# Altium project HU_revB.PrjPcb (part 2 of 4)

## Sheet RPI_CM5_PINOUT.SchDoc
size C; SheetNumber: 4; SheetTotal: 17
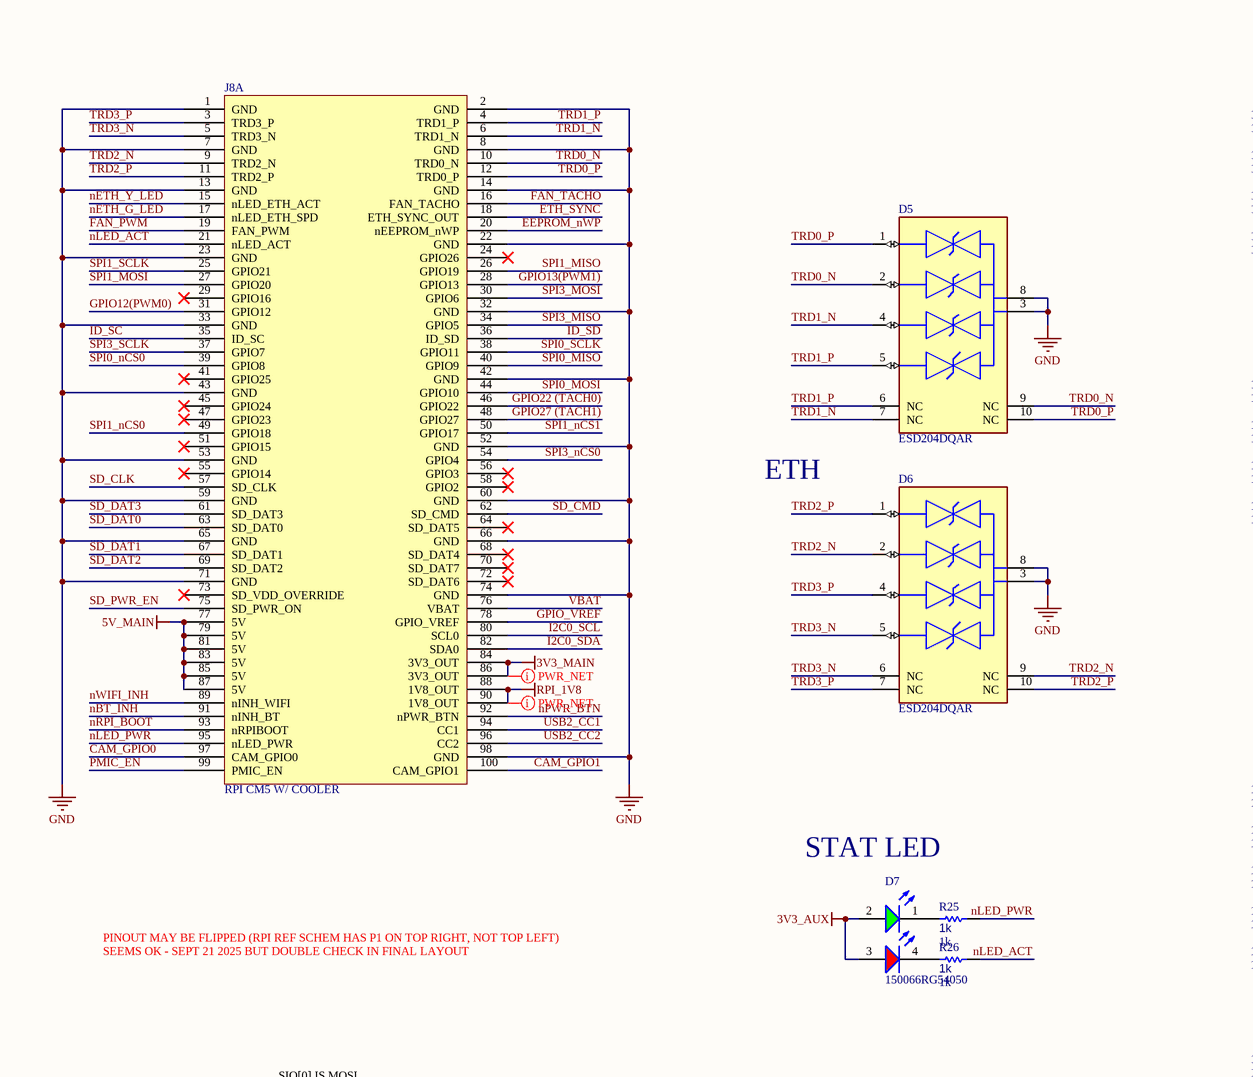
[diagram p6: RPI_CM5_PINOUT.SchDoc, top left]
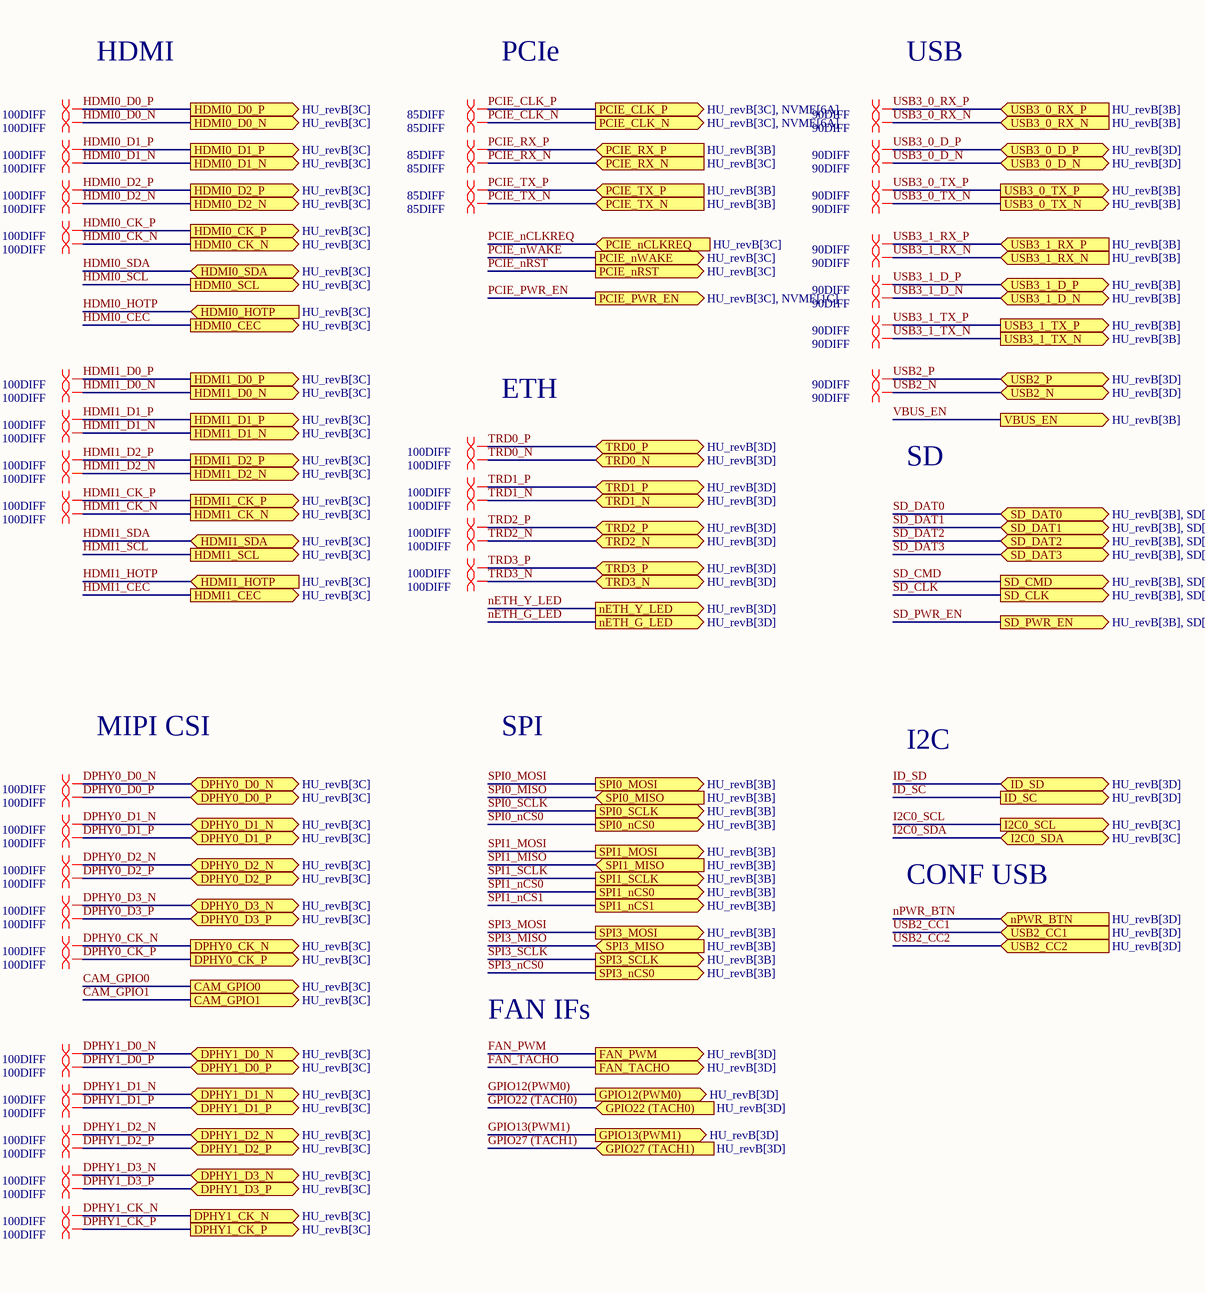
[diagram p7: RPI_CM5_PINOUT.SchDoc, top right]
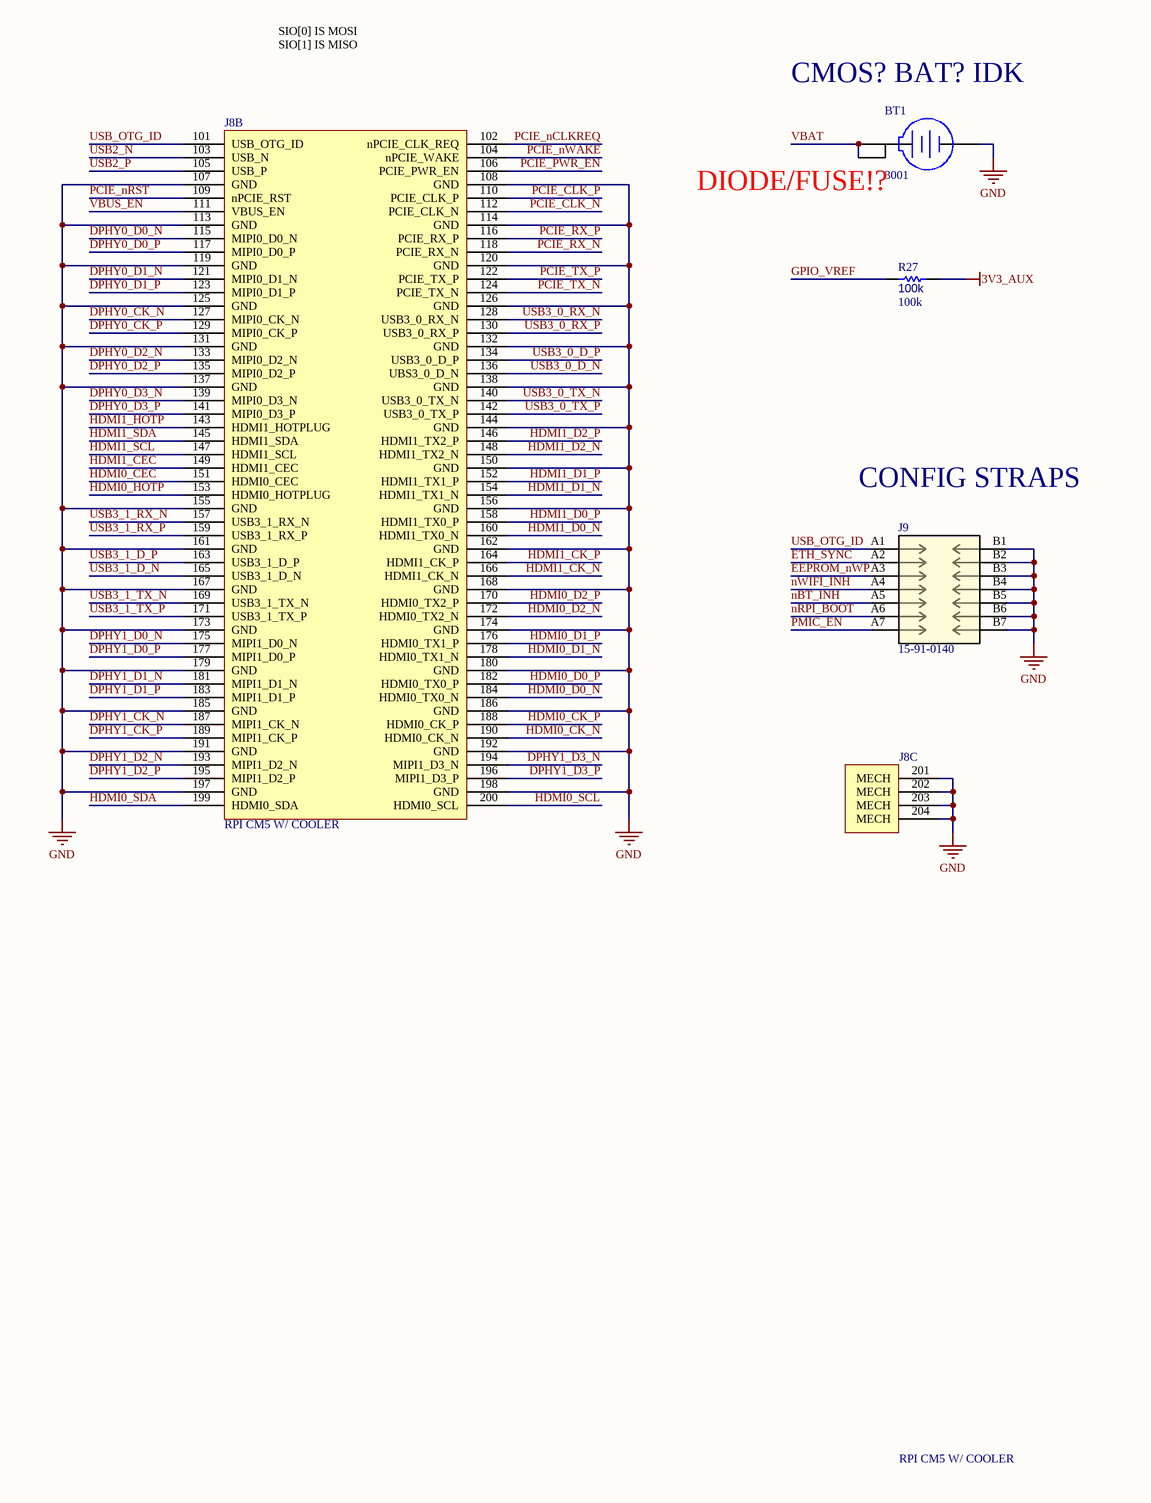
[diagram p8: RPI_CM5_PINOUT.SchDoc, bottom left]
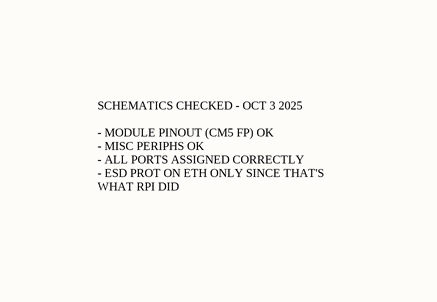
[diagram p9: RPI_CM5_PINOUT.SchDoc, bottom right]

### Parts
BT1  3001  [KSTN-3001_V]
D5  ESD204DQAR  [FP-DQA0010A-MFG]
D6  ESD204DQAR  [FP-DQA0010A-MFG]
D7  150066RG54050  [WL-SBCD_0606]
J8  RPI CM5 W/ COOLER  [RPI CM5 W_ COOLER-Footprint-1]  (parts A,B,C of 3)
J9  15-91-0140  [15-91-0140-Footprint-1]
R25  1k  [R0603B]
R26  1k  [R0603B]
R27  100k  [R0603B]

### Ports
CAM_GPIO0 (out, see HU_revB[3C]), CAM_GPIO1 (out, see HU_revB[3C]), DPHY0_CK_N (out, see HU_revB[3C]), DPHY0_CK_P (out, see HU_revB[3C]), DPHY0_D0_N (bidir, see HU_revB[3C]), DPHY0_D0_P (bidir, see HU_revB[3C]), DPHY0_D1_N (bidir, see HU_revB[3C]), DPHY0_D1_P (bidir, see HU_revB[3C]), DPHY0_D2_N (bidir, see HU_revB[3C]), DPHY0_D2_P (bidir, see HU_revB[3C]), DPHY0_D3_N (bidir, see HU_revB[3C]), DPHY0_D3_P (bidir, see HU_revB[3C]), DPHY1_CK_N (out, see HU_revB[3C]), DPHY1_CK_P (out, see HU_revB[3C]), DPHY1_D0_N (bidir, see HU_revB[3C]), DPHY1_D0_P (bidir, see HU_revB[3C]), DPHY1_D1_N (bidir, see HU_revB[3C]), DPHY1_D1_P (bidir, see HU_revB[3C]), DPHY1_D2_N (bidir, see HU_revB[3C]), DPHY1_D2_P (bidir, see HU_revB[3C]), DPHY1_D3_N (bidir, see HU_revB[3C]), DPHY1_D3_P (bidir, see HU_revB[3C]), FAN_PWM (out, see HU_revB[3D]), FAN_TACHO (out, see HU_revB[3D]), GPIO12(PWM0) (out, see HU_revB[3D]), GPIO13(PWM1) (out, see HU_revB[3D]), GPIO22 (TACH0) (in, see HU_revB[3D]), GPIO27 (TACH1) (in, see HU_revB[3D]), HDMI0_CEC (out, see HU_revB[3C]), HDMI0_CK_N (out, see HU_revB[3C]), HDMI0_CK_P (out, see HU_revB[3C]), HDMI0_D0_N (out, see HU_revB[3C]), HDMI0_D0_P (out, see HU_revB[3C]), HDMI0_D1_N (out, see HU_revB[3C]), HDMI0_D1_P (out, see HU_revB[3C]), HDMI0_D2_N (out, see HU_revB[3C]), HDMI0_D2_P (out, see HU_revB[3C]), HDMI0_HOTP (in, see HU_revB[3C]), HDMI0_SCL (out, see HU_revB[3C]), HDMI0_SDA (bidir, see HU_revB[3C]), HDMI1_CEC (out, see HU_revB[3C]), HDMI1_CK_N (out, see HU_revB[3C]), HDMI1_CK_P (out, see HU_revB[3C]), HDMI1_D0_N (out, see HU_revB[3C]), HDMI1_D0_P (out, see HU_revB[3C]), HDMI1_D1_N (out, see HU_revB[3C]), HDMI1_D1_P (out, see HU_revB[3C]), HDMI1_D2_N (out, see HU_revB[3C]), HDMI1_D2_P (out, see HU_revB[3C]), HDMI1_HOTP (in, see HU_revB[3C]), HDMI1_SCL (out, see HU_revB[3C]), HDMI1_SDA (bidir, see HU_revB[3C]), I2C0_SCL (out, see HU_revB[3C]), I2C0_SDA (bidir, see HU_revB[3C]), ID_SC (out, see HU_revB[3D]), ID_SD (bidir, see HU_revB[3D]), nETH_G_LED (out, see HU_revB[3D]), nETH_Y_LED (out, see HU_revB[3D]), nPWR_BTN (in, see HU_revB[3D]), PCIE_CLK_N (out, see HU_revB[3C], NVME[6A]), PCIE_CLK_P (out, see HU_revB[3C], NVME[6A]), PCIE_nCLKREQ (in, see HU_revB[3C]), PCIE_nRST (out, see HU_revB[3C]), PCIE_nWAKE (out, see HU_revB[3C]), PCIE_PWR_EN (out, see HU_revB[3C], NVME[1C]), PCIE_RX_N (in, see HU_revB[3C]), PCIE_RX_P (in, see HU_revB[3B]), PCIE_TX_N (in, see HU_revB[3B]), PCIE_TX_P (in, see HU_revB[3B]), SD_CLK (out, see HU_revB[3B], SD[3B]), SD_CMD (out, see HU_revB[3B], SD[3B]), SD_DAT0 (bidir, see HU_revB[3B], SD[3B]), SD_DAT1 (bidir, see HU_revB[3B], SD[3B]), SD_DAT2 (bidir, see HU_revB[3B], SD[3B]), SD_DAT3 (bidir, see HU_revB[3B], SD[3B]), SD_PWR_EN (out, see HU_revB[3B], SD[1B]), SPI0_MISO (in, see HU_revB[3B]), SPI0_MOSI (out, see HU_revB[3B]), SPI0_nCS0 (out, see HU_revB[3B]), SPI0_SCLK (out, see HU_revB[3B]), SPI1_MISO (in, see HU_revB[3B]), SPI1_MOSI (out, see HU_revB[3B]), SPI1_nCS0 (out, see HU_revB[3B]), SPI1_nCS1 (out, see HU_revB[3B]), SPI1_SCLK (out, see HU_revB[3B]), SPI3_MISO (in, see HU_revB[3B]), SPI3_MOSI (out, see HU_revB[3B]), SPI3_nCS0 (out, see HU_revB[3B]), SPI3_SCLK (out, see HU_revB[3B]), TRD0_N (bidir, see HU_revB[3D]), TRD0_P (bidir, see HU_revB[3D]), TRD1_N (bidir, see HU_revB[3D]), TRD1_P (bidir, see HU_revB[3D]), TRD2_N (bidir, see HU_revB[3D]), TRD2_P (bidir, see HU_revB[3D]), TRD3_N (bidir, see HU_revB[3D]), TRD3_P (bidir, see HU_revB[3D]), USB2_CC1 (in, see HU_revB[3D]), USB2_CC2 (in, see HU_revB[3D]), USB2_N (bidir, see HU_revB[3D]), USB2_P (bidir, see HU_revB[3D]), USB3_0_D_N (bidir, see HU_revB[3D]), USB3_0_D_P (bidir, see HU_revB[3D]), USB3_0_RX_N (in, see HU_revB[3B]), USB3_0_RX_P (in, see HU_revB[3B]), USB3_0_TX_N (out, see HU_revB[3B]), USB3_0_TX_P (out, see HU_revB[3B]), USB3_1_D_N (bidir, see HU_revB[3B]), USB3_1_D_P (bidir, see HU_revB[3B]), USB3_1_RX_N (in, see HU_revB[3B]), USB3_1_RX_P (in, see HU_revB[3B]), USB3_1_TX_N (out, see HU_revB[3B]), USB3_1_TX_P (out, see HU_revB[3B]), VBUS_EN (out, see HU_revB[3B])

### Nets
3V3_AUX: D7.2(A) D7.3(A) R27.2
3V3_MAIN: J8.84(3V3_OUT) J8.86(3V3_OUT)
5V_MAIN: J8.77(5V) J8.79(5V) J8.81(5V) J8.83(5V) J8.85(5V) J8.87(5V)
GND: BT1.3(-) D5.3(GND) D5.8(GND) D6.3(GND) D6.8(GND) J8.1(GND) J8.2(GND) J8.7(GND) J8.8(GND) J8.13(GND) J8.14(GND) J8.22(GND) J8.23(GND) J8.32(GND) J8.33(GND) J8.42(GND) J8.43(GND) J8.52(GND) J8.53(GND) J8.59(GND) J8.60(GND) J8.65(GND) J8.66(GND) J8.71(GND) J8.74(GND) J8.98(GND) J8.107(GND) J8.108(GND) J8.113(GND) J8.114(GND) J8.119(GND) J8.120(GND) J8.125(GND) J8.126(GND) J8.131(GND) J8.132(GND) J8.137(GND) J8.138(GND) J8.144(GND) J8.150(GND) J8.155(GND) J8.156(GND) J8.161(GND) J8.162(GND) J8.167(GND) J8.168(GND) J8.173(GND) J8.174(GND) J8.179(GND) J8.180(GND) J8.185(GND) J8.186(GND) J8.191(GND) J8.192(GND) J8.197(GND) J8.198(GND) J8.201(MECH) J8.202(MECH) J8.203(MECH) J8.204(MECH) J9.B1 J9.B2 J9.B3 J9.B4 J9.B5 J9.B6 J9.B7
RPI_1V8: J8.88(1V8_OUT) J8.90(1V8_OUT)
CAM_GPIO0: J8.97(CAM_GPIO0) ; port CAM_GPIO0
CAM_GPIO1: J8.100(CAM_GPIO1) ; port CAM_GPIO1
DPHY0_CK_N: J8.127(MIPI0_CK_N) ; port DPHY0_CK_N
DPHY0_CK_P: J8.129(MIPI0_CK_P) ; port DPHY0_CK_P
DPHY0_D0_N: J8.115(MIPI0_D0_N) ; port DPHY0_D0_N
DPHY0_D0_P: J8.117(MIPI0_D0_P) ; port DPHY0_D0_P
DPHY0_D1_N: J8.121(MIPI0_D1_N) ; port DPHY0_D1_N
DPHY0_D1_P: J8.123(MIPI0_D1_P) ; port DPHY0_D1_P
DPHY0_D2_N: J8.133(MIPI0_D2_N) ; port DPHY0_D2_N
DPHY0_D2_P: J8.135(MIPI0_D2_P) ; port DPHY0_D2_P
DPHY0_D3_N: J8.139(MIPI0_D3_N) ; port DPHY0_D3_N
DPHY0_D3_P: J8.141(MIPI0_D3_P) ; port DPHY0_D3_P
DPHY1_CK_N: J8.187(MIPI1_CK_N) ; port DPHY1_CK_N
DPHY1_CK_P: J8.189(MIPI1_CK_P) ; port DPHY1_CK_P
DPHY1_D0_N: J8.175(MIPI1_D0_N) ; port DPHY1_D0_N
DPHY1_D0_P: J8.177(MIPI1_D0_P) ; port DPHY1_D0_P
DPHY1_D1_N: J8.181(MIPI1_D1_N) ; port DPHY1_D1_N
DPHY1_D1_P: J8.183(MIPI1_D1_P) ; port DPHY1_D1_P
DPHY1_D2_N: J8.193(MIPI1_D2_N) ; port DPHY1_D2_N
DPHY1_D2_P: J8.195(MIPI1_D2_P) ; port DPHY1_D2_P
DPHY1_D3_N: J8.194(MIPI1_D3_N) ; port DPHY1_D3_N
DPHY1_D3_P: J8.196(MIPI1_D3_P) ; port DPHY1_D3_P
EEPROM_nWP: J8.20(nEEPROM_nWP) J9.A3
ETH_SYNC: J8.18(ETH_SYNC_OUT) J9.A2
FAN_PWM: J8.19(FAN_PWM) ; port FAN_PWM
FAN_TACHO: J8.16(FAN_TACHO) ; port FAN_TACHO
GPIO12(PWM0): J8.31(GPIO12) ; port GPIO12(PWM0)  [project net CH0_GPIO]
GPIO13(PWM1): J8.28(GPIO13) ; port GPIO13(PWM1)  [project net CH1_GPIO]
GPIO22 (TACH0): J8.46(GPIO22) ; port GPIO22 (TACH0)  [project net CH0_FAN_TACH]
GPIO27 (TACH1): J8.48(GPIO27) ; port GPIO27 (TACH1)  [project net CH1_FAN_TACH]
GPIO_VREF: J8.78(GPIO_VREF) R27.1
HDMI0_CEC: J8.151(HDMI0_CEC) ; port HDMI0_CEC
HDMI0_CK_N: J8.190(HDMI0_CK_N) ; port HDMI0_CK_N
HDMI0_CK_P: J8.188(HDMI0_CK_P) ; port HDMI0_CK_P
HDMI0_D0_N: J8.184(HDMI0_TX0_N) ; port HDMI0_D0_N
HDMI0_D0_P: J8.182(HDMI0_TX0_P) ; port HDMI0_D0_P
HDMI0_D1_N: J8.178(HDMI0_TX1_N) ; port HDMI0_D1_N
HDMI0_D1_P: J8.176(HDMI0_TX1_P) ; port HDMI0_D1_P
HDMI0_D2_N: J8.172(HDMI0_TX2_N) ; port HDMI0_D2_N
HDMI0_D2_P: J8.170(HDMI0_TX2_P) ; port HDMI0_D2_P
HDMI0_HOTP: J8.153(HDMI0_HOTPLUG) ; port HDMI0_HOTP
HDMI0_SCL: J8.200(HDMI0_SCL) ; port HDMI0_SCL
HDMI0_SDA: J8.199(HDMI0_SDA) ; port HDMI0_SDA
HDMI1_CEC: J8.149(HDMI1_CEC) ; port HDMI1_CEC
HDMI1_CK_N: J8.166(HDMI1_CK_N) ; port HDMI1_CK_N
HDMI1_CK_P: J8.164(HDMI1_CK_P) ; port HDMI1_CK_P
HDMI1_D0_N: J8.160(HDMI1_TX0_N) ; port HDMI1_D0_N
HDMI1_D0_P: J8.158(HDMI1_TX0_P) ; port HDMI1_D0_P
HDMI1_D1_N: J8.154(HDMI1_TX1_N) ; port HDMI1_D1_N
HDMI1_D1_P: J8.152(HDMI1_TX1_P) ; port HDMI1_D1_P
HDMI1_D2_N: J8.148(HDMI1_TX2_N) ; port HDMI1_D2_N
HDMI1_D2_P: J8.146(HDMI1_TX2_P) ; port HDMI1_D2_P
HDMI1_HOTP: J8.143(HDMI1_HOTPLUG) ; port HDMI1_HOTP
HDMI1_SCL: J8.147(HDMI1_SCL) ; port HDMI1_SCL
HDMI1_SDA: J8.145(HDMI1_SDA) ; port HDMI1_SDA
I2C0_SCL: J8.80(SCL0) ; port I2C0_SCL  [project net CONF_SCL]
I2C0_SDA: J8.82(SDA0) ; port I2C0_SDA  [project net CONF_SDA]
ID_SC: J8.35(ID_SC) ; port ID_SC
ID_SD: J8.36(ID_SD) ; port ID_SD
nBT_INH: J8.91(nINH_BT) J9.A5
nETH_G_LED: J8.17(nLED_ETH_SPD) ; port nETH_G_LED
nETH_Y_LED: J8.15(nLED_ETH_ACT) ; port nETH_Y_LED
nLED_ACT: J8.21(nLED_ACT) R26.2
nLED_PWR: J8.95(nLED_PWR) R25.2
nPWR_BTN: J8.92(nPWR_BTN) ; port nPWR_BTN
nRPI_BOOT: J8.93(nRPIBOOT) J9.A6
nWIFI_INH: J8.89(nINH_WIFI) J9.A4
PCIE_CLK_N: J8.112(PCIE_CLK_N) ; port PCIE_CLK_N
PCIE_CLK_P: J8.110(PCIE_CLK_P) ; port PCIE_CLK_P
PCIE_nCLKREQ: J8.102(nPCIE_CLK_REQ) ; port PCIE_nCLKREQ
PCIE_nRST: J8.109(nPCIE_RST) ; port PCIE_nRST
PCIE_nWAKE: J8.104(nPCIE_WAKE) ; port PCIE_nWAKE
PCIE_PWR_EN: J8.106(PCIE_PWR_EN) ; port PCIE_PWR_EN
PCIE_RX_N: J8.118(PCIE_RX_N) ; port PCIE_RX_N  [project net PCIE_RX0_N]
PCIE_RX_P: J8.116(PCIE_RX_P) ; port PCIE_RX_P  [project net PCIE_RX0_P]
PCIE_TX_N: J8.124(PCIE_TX_N) ; port PCIE_TX_N  [project net PCIE_TX0_N]
PCIE_TX_P: J8.122(PCIE_TX_P) ; port PCIE_TX_P  [project net PCIE_TX0_P]
PMIC_EN: J8.99(PMIC_EN) J9.A7
SD_CLK: J8.57(SD_CLK) ; port SD_CLK
SD_CMD: J8.62(SD_CMD) ; port SD_CMD
SD_DAT0: J8.63(SD_DAT0) ; port SD_DAT0
SD_DAT1: J8.67(SD_DAT1) ; port SD_DAT1
SD_DAT2: J8.69(SD_DAT2) ; port SD_DAT2
SD_DAT3: J8.61(SD_DAT3) ; port SD_DAT3
SD_PWR_EN: J8.75(SD_PWR_ON) ; port SD_PWR_EN
SPI0_MISO: J8.40(GPIO9) ; port SPI0_MISO
SPI0_MOSI: J8.44(GPIO10) ; port SPI0_MOSI
SPI0_nCS0: J8.39(GPIO8) ; port SPI0_nCS0
SPI0_SCLK: J8.38(GPIO11) ; port SPI0_SCLK
SPI1_MISO: J8.26(GPIO19) ; port SPI1_MISO
SPI1_MOSI: J8.27(GPIO20) ; port SPI1_MOSI
SPI1_nCS0: J8.49(GPIO18) ; port SPI1_nCS0
SPI1_nCS1: J8.50(GPIO17) ; port SPI1_nCS1
SPI1_SCLK: J8.25(GPIO21) ; port SPI1_SCLK
SPI3_MISO: J8.34(GPIO5) ; port SPI3_MISO
SPI3_MOSI: J8.30(GPIO6) ; port SPI3_MOSI
SPI3_nCS0: J8.54(GPIO4) ; port SPI3_nCS0
SPI3_SCLK: J8.37(GPIO7) ; port SPI3_SCLK
TRD0_N: D5.2(IO2) D5.9(NC) J8.10(TRD0_N) ; port TRD0_N
TRD0_P: D5.1(IO1) D5.10(NC) J8.12(TRD0_P) ; port TRD0_P
TRD1_N: D5.4(IO3) D5.7(NC) J8.6(TRD1_N) ; port TRD1_N
TRD1_P: D5.5(IO4) D5.6(NC) J8.4(TRD1_P) ; port TRD1_P
TRD2_N: D6.2(IO2) D6.9(NC) J8.9(TRD2_N) ; port TRD2_N
TRD2_P: D6.1(IO1) D6.10(NC) J8.11(TRD2_P) ; port TRD2_P
TRD3_N: D6.5(IO4) D6.6(NC) J8.5(TRD3_N) ; port TRD3_N
TRD3_P: D6.4(IO3) D6.7(NC) J8.3(TRD3_P) ; port TRD3_P
USB2_CC1: J8.94(CC1) ; port USB2_CC1
USB2_CC2: J8.96(CC2) ; port USB2_CC2
USB2_N: J8.103(USB_N) ; port USB2_N  [project net PRE_RC_DBG_USB_N]
USB2_P: J8.105(USB_P) ; port USB2_P  [project net PRE_RC_DBG_USB_P]
USB3_0_D_N: J8.136(UBS3_0_D_N) ; port USB3_0_D_N
USB3_0_D_P: J8.134(USB3_0_D_P) ; port USB3_0_D_P
USB3_0_RX_N: J8.128(USB3_0_RX_N) ; port USB3_0_RX_N
USB3_0_RX_P: J8.130(USB3_0_RX_P) ; port USB3_0_RX_P
USB3_0_TX_N: J8.140(USB3_0_TX_N) ; port USB3_0_TX_N
USB3_0_TX_P: J8.142(USB3_0_TX_P) ; port USB3_0_TX_P
USB3_1_D_N: J8.165(USB3_1_D_N) ; port USB3_1_D_N
USB3_1_D_P: J8.163(USB3_1_D_P) ; port USB3_1_D_P
USB3_1_RX_N: J8.157(USB3_1_RX_N) ; port USB3_1_RX_N
USB3_1_RX_P: J8.159(USB3_1_RX_P) ; port USB3_1_RX_P
USB3_1_TX_N: J8.169(USB3_1_TX_N) ; port USB3_1_TX_N
USB3_1_TX_P: J8.171(USB3_1_TX_P) ; port USB3_1_TX_P
USB_OTG_ID: J8.101(USB_OTG_ID) J9.A1
VBAT: BT1.1(+) BT1.2(+) J8.76(VBAT)
VBUS_EN: J8.111(VBUS_EN) ; port VBUS_EN  [project net USB_VBUS_EN]
NetD7_1: D7.1(K) R25.1
NetD7_4: D7.4(K) R26.1

Not connected (* = marked no-connect by the designer): J8 24(GPIO26)* 29(GPIO16)* 41(GPIO25)* 45(GPIO24)* 47(GPIO23)* 51(GPIO15)* 55(GPIO14)* 56(GPIO3)* 58(GPIO2)* 64(SD_DAT5)* 68(SD_DAT4)* 70(SD_DAT7)* 72(SD_DAT6)* 73(SD_VDD_OVERRIDE)*

### Layout directives
differential pair; differential pair class 90DIFF: PRE_RC_DBG_USB_N, PRE_RC_DBG_USB_P, USB3_0_D_N, USB3_0_D_P, USB3_0_RX_N, USB3_0_RX_P, USB3_0_TX_N, USB3_0_TX_P, USB3_1_D_N, USB3_1_D_P, USB3_1_RX_N, USB3_1_RX_P, USB3_1_TX_N, USB3_1_TX_P
differential pair; differential pair class 100DIFF: DPHY0_CK_N, DPHY0_CK_P, DPHY0_D0_N, DPHY0_D0_P, DPHY0_D1_N, DPHY0_D1_P, DPHY0_D2_N, DPHY0_D2_P, DPHY0_D3_N, DPHY0_D3_P, DPHY1_CK_N, DPHY1_CK_P, DPHY1_D0_N, DPHY1_D0_P, DPHY1_D1_N, DPHY1_D1_P, DPHY1_D2_N, DPHY1_D2_P, DPHY1_D3_N, DPHY1_D3_P, HDMI0_CK_N, HDMI0_CK_P, HDMI0_D0_N, HDMI0_D0_P, HDMI0_D1_N, HDMI0_D1_P, HDMI0_D2_N, HDMI0_D2_P, HDMI1_CK_N, HDMI1_CK_P, HDMI1_D0_N, HDMI1_D0_P, HDMI1_D1_N, HDMI1_D1_P, HDMI1_D2_N, HDMI1_D2_P, TRD0_N, TRD0_P, TRD1_N, TRD1_P, TRD2_N, TRD2_P, TRD3_N, TRD3_P
differential pair; differential pair class 85DIFF: PCIE_CLK_N, PCIE_CLK_P, PCIE_RX0_N, PCIE_RX0_P, PCIE_TX0_N, PCIE_TX0_P
net class PWR: 3V3_MAIN, RPI_1V8

### Notes on the sheet
- HDMI
- PCIe
- USB
- ETH
- SD
- MIPI CSI
- SPI
- I2C
- STAT LED
- PINOUT MAY BE FLIPPED (RPI REF SCHEM HAS P1 ON TOP RIGHT, NOT TOP LEFT)
- CONF USB
- SEEMS OK - SEPT 21 2025 BUT DOUBLE CHECK IN FINAL LAYOUT
- FAN IFs
- SIO[0] IS MOSI
  SIO[1] IS MISO
- CMOS? BAT? IDK
- (near BT1) DIODE/FUSE!?
- CONFIG STRAPS
- SCHEMATICS CHECKED - OCT 3 2025
  - MODULE PINOUT (CM5 FP) OK
  - MISC PERIPHS OK
  - ALL PORTS ASSIGNED CORRECTLY
  - ESD PROT ON ETH ONLY SINCE THAT'S WHAT RPI DID

### Library data of the parts
BT1 = CMP-2000-05463-1: Holder Battery Coin, 12 mm, 2-Pin THD, RoHS; Manufacturer: Keystone; Package Reference: 3001; Package Description: 2-Pin Through Hole Device, Body 13.21 x 12.07 mm; Datasheet Version: Rev. H, 09/2006; Datasheet URL: https://datasheet.ciiva.com/3/3001-3954.pdf; Mounting Technology: ThroughHole; Manufacturer URL: http://www.keyelco.com/
D5 D6 = CMP-04989-000002-1: 4-CHANNEL LOW-CAPACITANCE SURGE; Manufacturer: Texas Instruments; Value: 0.55pF; Reverse Standoff Voltage: 3.6V; Standoff Height: 0mm; Breakdown Voltage: 5.5V; Peak Pulse Current: 5.5A; Clamping Voltage: 11.5V; Direction: Bidirectional; Peak Pulse Power: 50W; Number Of Channels: 4; Ambient Temperature Range High: +125°C; ComponentLink2Description: Datasheet; Height: 0.55mm; Lead Free: Yes; Device Class L3: unset; Temperature Range High: +125°C; Temperature Range Low: -40°C; Package: DQA0010A; Temperature: -40°C to +125°C; Capacitance: 0.55pF; RoHS: TRUE; Mouser Description: 4-Channel Low-Capacitance Surge and ESD Protection Diode 10-USON -40 to 125; Category: Diode; Device Class L1: Circuit Protection; Octopart: https://octopart.com/esd204dqar-texas+instruments-89917476; Device Class L2: TVS Diodes; Ambient Temperature Range Low: -40°C; Manufacturer Part Number: ESD204DQAR; ComponentLink2URL: http://www.ti.com/lit/ds/symlink/esd204.pdf; Automotive: No; Digikey Description: 4-CHANNEL LOW-CAPACITANCE SURGE
D7 = CMP-004-00040-2: Led, Red/Grn, 180Mcd/230Mcd, 624Nm/525Nm Rohs Compliant: Yes; Source: rgled.SchLib; Component Type: Standard; Pins: 4; Design Item ID: CMP-004-00034-2
J8 = CMP-00028-00005-4: Mechanical placeholder for RPI CM5 w/ active cooler on it
J9 = CMP-002-00093-2: Conn.; Rect./PCB; Header; 14 Circuit; SMT; Dual Row; Vertical; C-Grid Series; Gold Plate; Gender: Male; Min Operating Temperature: -40°C; Max Operating Temperature: 105°C; Mounting Technology: Surface Mount; Pins: 14
R25-R27 = CMP-009-00002-14: Resistor
  R25 R26: Value: 1k
  R27: Value: 100k

## Sheet 5V_REG.SchDoc
size B; SheetNumber: 4; SheetTotal: 17
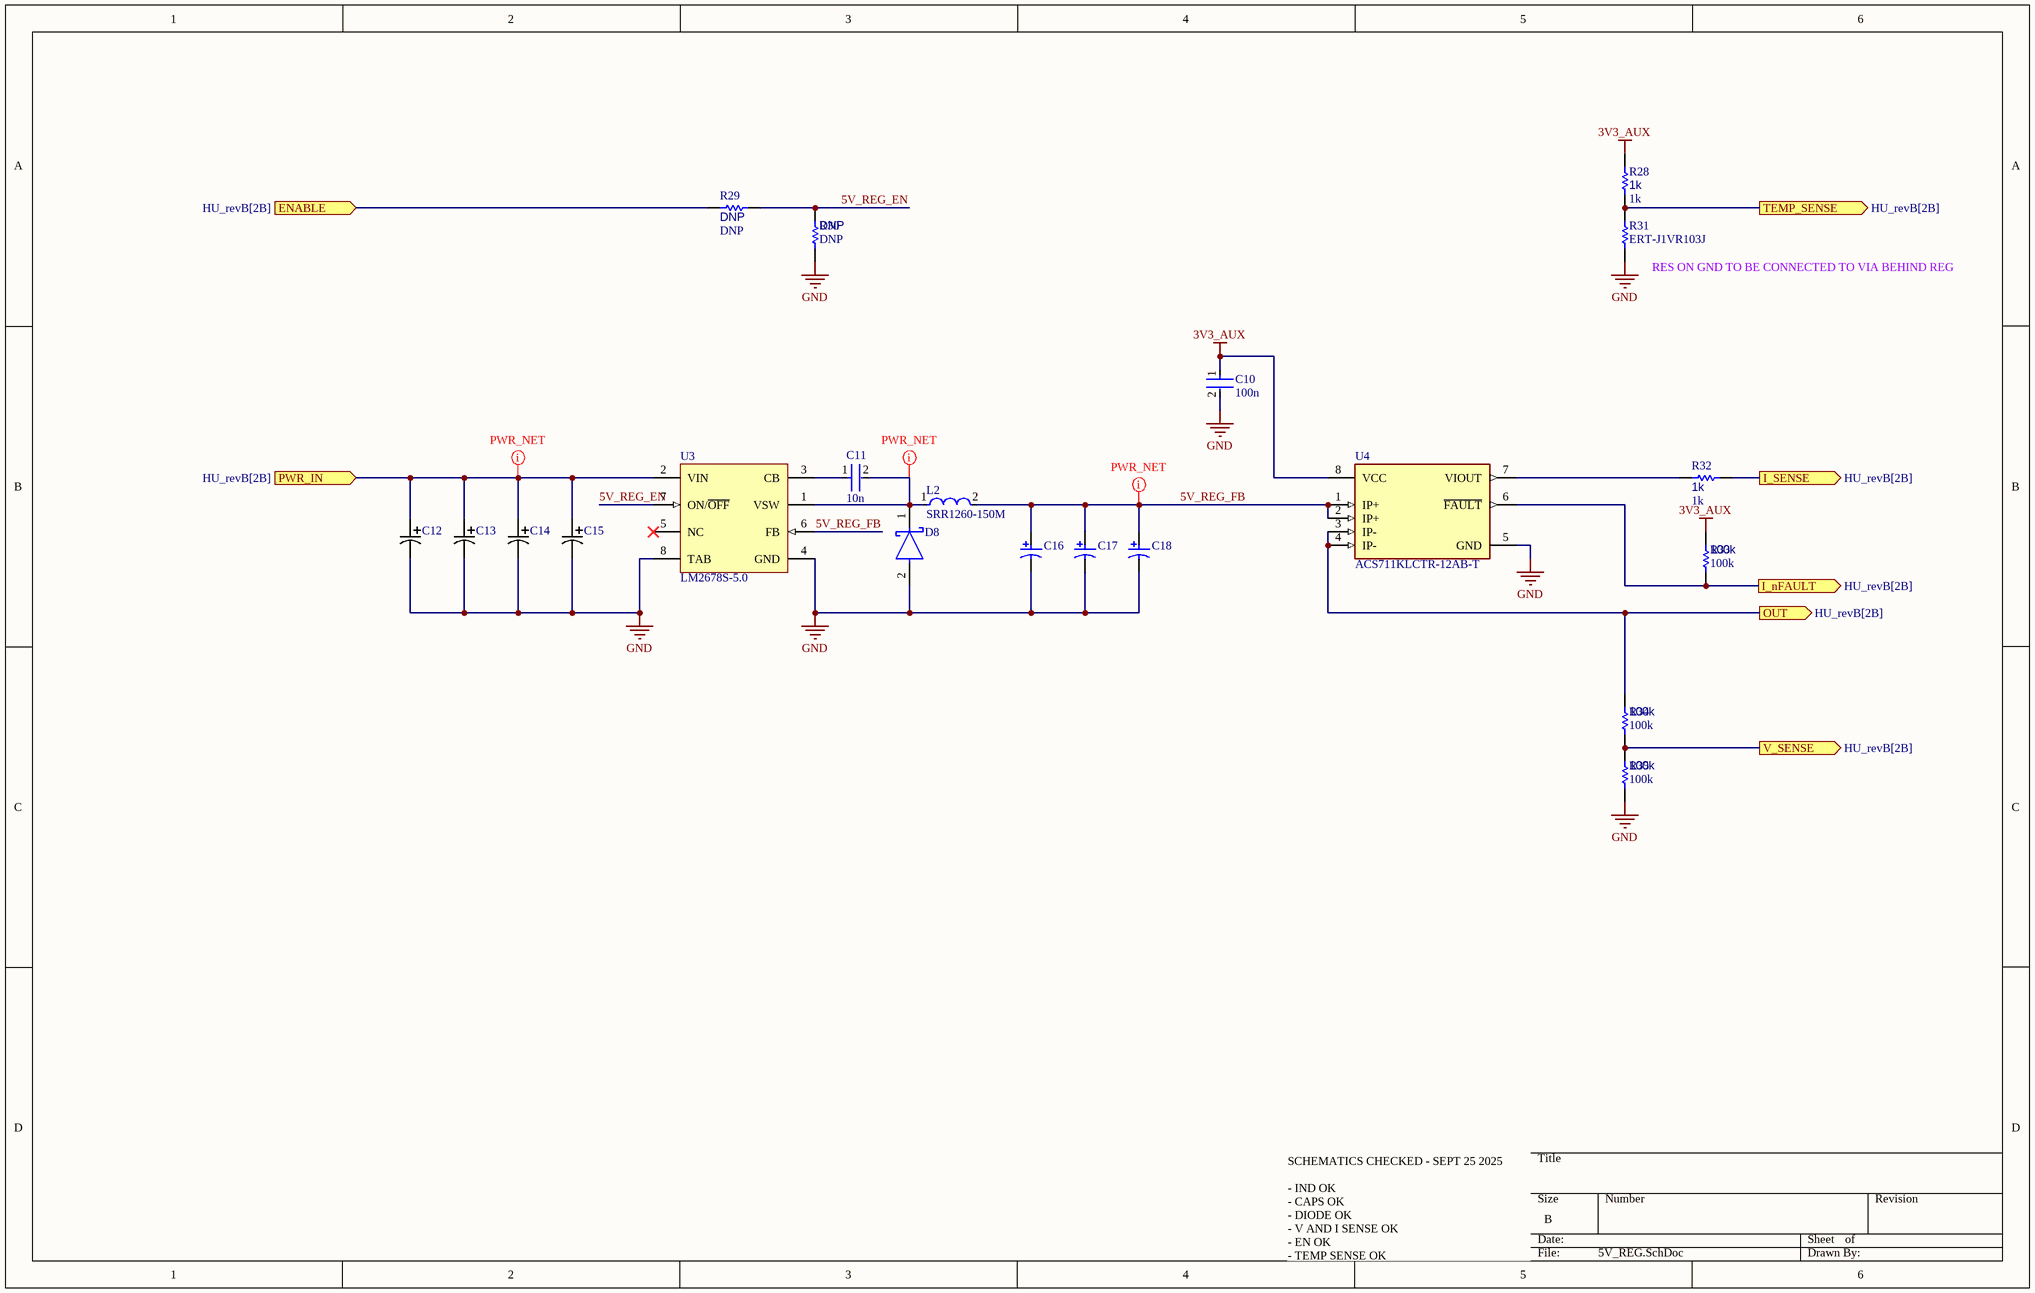
[diagram p10: 5V_REG.SchDoc]

### Parts
C10  100n  [FP-0402-L_1_0_0_05-W_0_5-IPC_A]
C11  10n  [FP-0402-L_1_0_0_05-W_0_5-IPC_A]
C12  T495D106M035ATE260  [T495D106M035ATE260-Footprint-1]  (value not drawn)
C13  T495D106M035ATE260  [T495D106M035ATE260-Footprint-1]  (value not drawn)
C14  T495D106M035ATE260  [T495D106M035ATE260-Footprint-1]  (value not drawn)
C15  T495D106M035ATE260  [T495D106M035ATE260-Footprint-1]  (value not drawn)
C16  T495D157K010ATE100  [KEMT-T495-D_L]  (value not drawn)
C17  T495D157K010ATE100  [KEMT-T495-D_L]  (value not drawn)
C18  T495D157K010ATE100  [KEMT-T495-D_L]  (value not drawn)
D8  B540C-13-F  [FP-SMC-MFG]  (value not drawn)
L2  SRR1260-150M  [FP-SRR1260-MFG]
R28  1k  [R0603B]
R29  DNP  [R0603B]
R30  DNP  [R0603B]
R31  ERT-J1VR103J  [RESC1608X90X30ML15T20]
R32  1k  [R0603B]
R33  100k  [R0603B]
R34  100k  [R0603B]
R35  100k  [R0603B]
U3  LM2678S-5.0  [KTW0007B_N]
U4  ACS711KLCTR-12AB-T  [FP-LC-8-IPC_C]

### Ports
ENABLE (in, see HU_revB[2B]), I_nFAULT (out, see HU_revB[2B]), I_SENSE (out, see HU_revB[2B]), OUT (out, see HU_revB[2B]), PWR_IN (in, see HU_revB[2B]), TEMP_SENSE (out, see HU_revB[2B]), V_SENSE (out, see HU_revB[2B])

### Nets
3V3_AUX: C10.1 R28.1 R33.2 U4.8(VCC)
5V_MAIN: R34.2 U4.3(IP-) U4.4(IP-) ; port OUT
GND: C10.2 C12.2 C13.2 C14.2 C15.2 C16.2 C17.2 C18.2 D8.2(A) R30.1 R31.1 R35.1 U3.4(GND) U3.8(TAB) U4.5(GND)
5V_REG_EN: R29.1 R30.2 U3.7(ON/~{OFF})
5V_REG_FB: C16.1 C17.1 C18.1 L2.2 U3.6(FB) U4.1(IP+) U4.2(IP+)
CAN_INH: R29.2 ; port ENABLE
NetC11_1: C11.1 U3.3(CB)
NetC11_2: C11.2 D8.1(C) L2.1 U3.1(VSW)
NetC12_1: C12.1 C13.1 C14.1 C15.1 U3.2(VIN) ; port PWR_IN
NetR28_2: R28.2 R31.2 ; port TEMP_SENSE
NetR32_1: R32.1 ; port I_SENSE
NetR32_2: R32.2 U4.7(VIOUT)
NetR33_1: R33.1 U4.6(~{FAULT}) ; port I_nFAULT
NetR34_1: R34.1 R35.2 ; port V_SENSE

Not connected (* = marked no-connect by the designer): U3 5(NC)*

### Layout directives
net class PWR: 5V_REG_FB, NetC11_2, NetC12_1

### Notes on the sheet
- (near R31) RES ON GND TO BE CONNECTED TO VIA BEHIND REG
- SCHEMATICS CHECKED - SEPT 25 2025
  - IND OK
  - CAPS OK
  - DIODE OK
  - V AND I SENSE OK
  - EN OK
  - TEMP SENSE OK

### Library data of the parts
C10 C11 = CMP-001-00058-1: as C1 on sheet HU_revB; Min Operating Temperature: -55°C; Mounting Technology: Surface Mount; Pins: 2; Case/Package: 0402; RoHS Compliant: Yes; Max Operating Temperature: 85°C
C12-C15 = CMP-001-00065-1: Tantalum Capacitor, Polarized, Tantalum (dry/solid), 35V, 20% +Tol, 20% -Tol, 10uF, Surface Mount, 2917; Value: 10µF; Case/Package: Molded; Mounting Technology: Surface Mount; Max Operating Temperature: 125°C; Tolerance: 20%; Min Operating Temperature: -55°C
C16-C18 = CMP-2000-07208-1: Capacitor, Tantalum, 150 uF, +/- 10%, 10 V, -55 to 125 degC, 2-Pin SMD, RoHS, Tape and Reel; Manufacturer: Kemet; Capacitance: 150µF; ESR: 0.1ohm; Voltage Rating: 10V; Capacitor Case Style: 2917; Package Description: 2-Pin Surface Mount Device, Body 7.3 x 4.3 mm; MSL: MSL1-Unlimited; Package Reference: T495-D; Mounting Technology: SurfaceMount; Datasheet URL: http://capacitoredge.kemet.com/capedge2/DataSheet/Datasheet-T495D157K010ATE100.pdf?pn=T495D157K010ATE100; Datasheet Version: 09/2016; Capacitance Tolerance: ±10%; Capacitor Terminals: SMD; Operating Temperature Range: -55°Cto+125°C; Manufacturer URL: http://www.kemet.com/
D8 = CMP-2000-05097-3: DIODE SCHOTTKY 40V 5A SMC; Manufacturer: Diodes Inc.; Automotive Grade: NA; Peak Reverse Current: 0.5mA; Value: 300pF; Max Junction Temp: +150°C; Max Surge Forward Current: 100A; Standoff Height: 0.1mm; Digikey Description: DIODE SCHOTTKY 40V 5A SMC; Temperature Range Low: -55°C; Manufacturer Part Number: B540C-13-F; Octopart: https://octopart.com/b540c-13-f-diodes+inc.-325873; Lead Free: Yes; Reverse Voltage: 40V; RoHS: TRUE; Category: Diode; Mouser Description: Diode: Schottky rectifying; SMD; 40V; 5A; SMC; Package: reel, tape; ComponentLink2Description: Datasheet; Temperature Range High: +150°C; Automotive: No; Footprint Url: https://www.diodes.com/assets/Package-Files/SMC.pdf; Device Class L3: Schottky Diodes; Height: 2.5mm; Forward Current: 5A; Temperature: -55°C to +150°C; Package: SMC; ComponentLink2URL: https://www.diodes.com/assets/Datasheets/ds13012.pdf; Device Class L2: Diodes; Max Repetitive Reverse Voltage: 40V; Device Class L1: Discrete Semiconductors; Capacitance: 300pF
L2 = CMP-2000-07146-2: FIXED IND 15UH 5A 27 MOHM SMD; Q Factor: 25; Sample Rate (Hz): 100kHz; Resistance: 27MR; Material: Steel; Inductance Tolerance: 20%; Frequency: 17.6MHz; Saturation Current: 4.6A; Core Material: Ferrite; Shielding: Shielded; Series: SRR1260; Termination: SMD/SMT; Packaging: Tape and Reel; RoHS Compliant: Yes; Height - Seated (Max): 0.256inch; Depth: 12.8mm; Case/Package: 1260; Inductance: 15uH; Height: 6mm; Number of Pins: 2; Mount: Surface Mount; Min Operating Temperature: -40°C; Test Frequency: 100kHz; Length: 12.5mm; Self Resonant Frequency: 17.6MHz; Current Rating: 5A; Tolerance: 20%; RMS Current (Irms): 5A; REACH SVHC: No SVHC; Resistor Type: Wirewound; DC Resistance (DCR): 27mR; Width: 12.5mm; Package Quantity: 600; DC Current: 5A; Max DC Current: 5A; Max Operating Temperature: 125°C; Military Standard: Not
R28-R30 R32-R35 = CMP-009-00002-14: Resistor
  R28 R32: Value: 1k
  R29 R30: Value: DNP
  R33-R35: Value: 100k
R31 = CMP-2000-00869-1: Manufacturer: Panasonic; Part Number: ERT-J1VR103J
U3 = CMP-0069-00190-3: SIMPLE SWITCHER® High Efficiency 5A Step-Down Voltage Regulator, 7-pin TO-263; Manufacturer: Texas Instruments; PowerWise: N; PackageTopMarking: NSUZXYTTE#*LM2678*S-5.0; RoHS: N; PinCount: 7; Code_JEDEC: MO-169-AC; ComponentLink1URL: http://www.ti.com/general/docs/lit/getliterature.tsp?genericPartNumber=LM2678&fileType=pdf; ComponentLink1Description: Datasheet URL; PackageReference: KTW0007B; PackageDescription: TO-263, Molded, .400 x .390 x .180in Body, 7 Lead, .050in Pitch, Surface Mount; CompType: Switcher
U4 = CMP-1557-00012-2: SENSOR CURRENT HALL 12.5A AC/DC; Number of Channels: 1; Min Supply Voltage: 3V; Sensitivity: 110mV/A; Response Time: 4.6us; Operating Supply Voltage: 3.3V; Max Supply Voltage: 5.5V; Max Supply Current: 5.5mA; Bandwidth: 100kHz; Linearity: 1%; Quiescent Current: 4mA; Accuracy: 5%; Polarity: Bidirectional; Case/Package: SOIC; Packaging: Tape and Reel; Number of Pins: 8; Width: 3.9mm; Frequency: 100kHz; -3db Bandwidth: 100kHz; REACH SVHC: No SVHC; Series: -; Height: 1.5mm; Package Quantity: 1; Min Operating Temperature: -40°C; Max Operating Temperature: 125°C; Current Sensing: 12.5A; RoHS Compliant: Yes; Length: 4.9mm

## Sheet NVME.SchDoc
size C; SheetNumber: 6; SheetTotal: 17
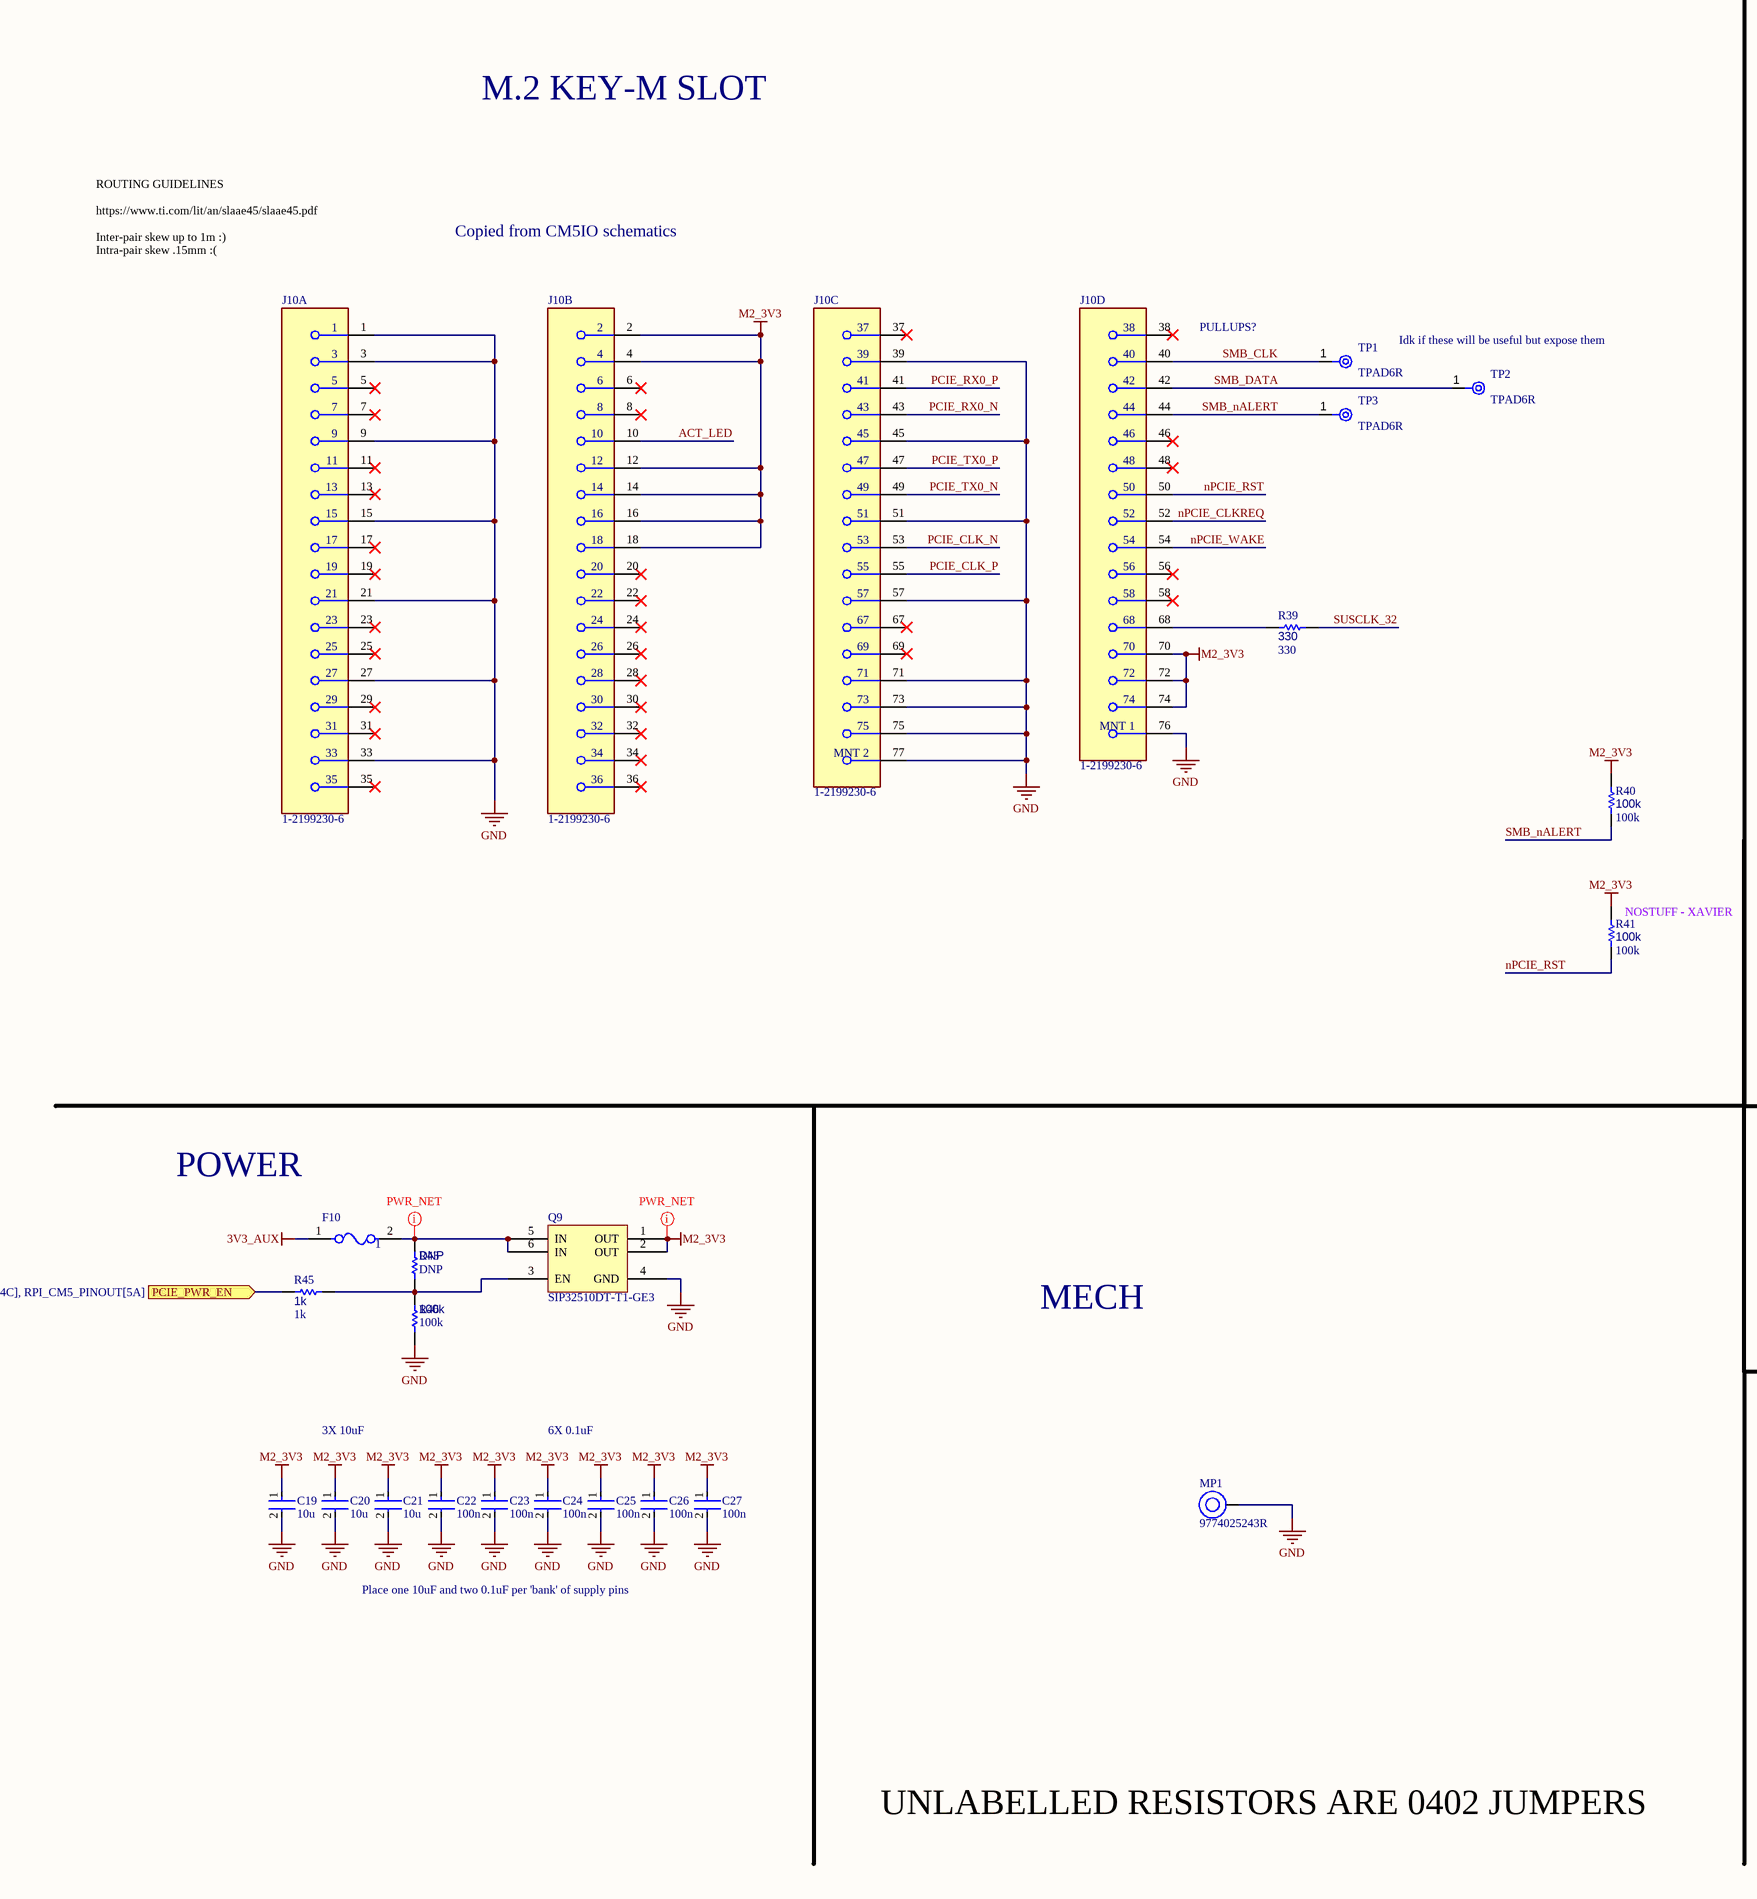
[diagram p11: NVME.SchDoc, left]
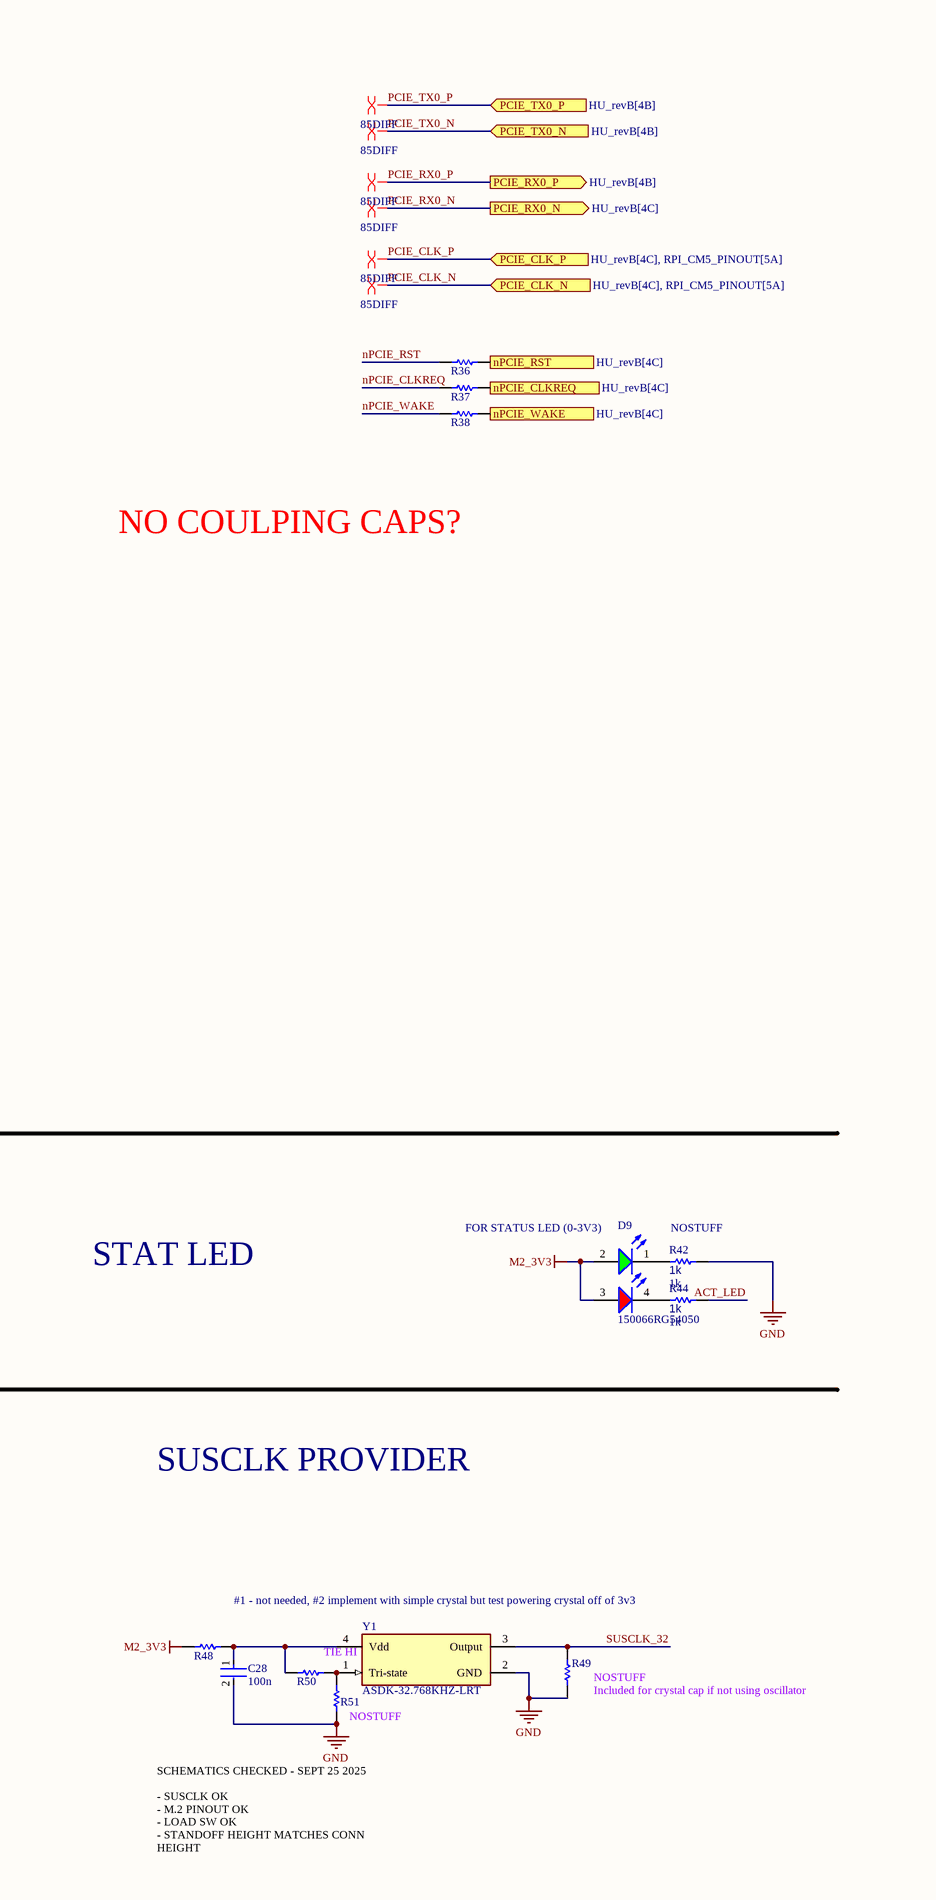
[diagram p12: NVME.SchDoc, right]

### Parts
C19  10u  [FP-0402-L_1_0_0_05-W_0_5-IPC_A]
C20  10u  [FP-0402-L_1_0_0_05-W_0_5-IPC_A]
C21  10u  [FP-0402-L_1_0_0_05-W_0_5-IPC_A]
C22  100n  [FP-0402-L_1_0_0_05-W_0_5-IPC_A]
C23  100n  [FP-0402-L_1_0_0_05-W_0_5-IPC_A]
C24  100n  [FP-0402-L_1_0_0_05-W_0_5-IPC_A]
C25  100n  [FP-0402-L_1_0_0_05-W_0_5-IPC_A]
C26  100n  [FP-0402-L_1_0_0_05-W_0_5-IPC_A]
C27  100n  [FP-0402-L_1_0_0_05-W_0_5-IPC_A]
C28  100n  [FP-0402-L_1_0_0_05-W_0_5-IPC_A]
D9  150066RG54050  [WL-SBCD_0606]
F10  1  [FP-0685T-MFG]
J10  1-2199230-6  [FP-1-2199230-6-MFG]  (parts A,B,C,D of 4)
MP1  9774025243R  [9774025243]
Q9  SIP32510DT-T1-GE3  [SOT95P284X110-6N]
R36  0402 JUMPER  [RESC1005X40X25ML05T05]  (value not drawn)
R37  0402 JUMPER  [RESC1005X40X25ML05T05]  (value not drawn)
R38  0402 JUMPER  [RESC1005X40X25ML05T05]  (value not drawn)
R39  330  [R0603B]
R40  100k  [R0603B]
R41  100k  [R0603B]
R42  1k  [R0603B]
R43  DNP  [R0603B]
R44  1k  [R0603B]
R45  1k  [R0603B]
R46  100k  [R0603B]
R48  0402 JUMPER  [RESC1005X40X25ML05T05]  (value not drawn)
R49  0402 JUMPER  [RESC1005X40X25ML05T05]  (value not drawn)
R50  0402 JUMPER  [RESC1005X40X25ML05T05]  (value not drawn)
R51  0402 JUMPER  [RESC1005X40X25ML05T05]  (value not drawn)
TP1  TPAD6R  [New footprint 1]
TP2  TPAD6R  [New footprint 1]
TP3  TPAD6R  [New footprint 1]
Y1  ASDK-32.768KHZ-LRT  [FP-ASDK-MFG]

### Ports
nPCIE_CLKREQ (out, see HU_revB[4C]), nPCIE_RST (in, see HU_revB[4C]), nPCIE_WAKE (out, see HU_revB[4C]), PCIE_CLK_N (in, see HU_revB[4C], RPI_CM5_PINOUT[5A]), PCIE_CLK_P (in, see HU_revB[4C], RPI_CM5_PINOUT[5A]), PCIE_PWR_EN (in, see HU_revB[4C], RPI_CM5_PINOUT[5A]), PCIE_RX0_N (out, see HU_revB[4C]), PCIE_RX0_P (out, see HU_revB[4B]), PCIE_TX0_N (in, see HU_revB[4B]), PCIE_TX0_P (in, see HU_revB[4B])

### Nets
3V3_AUX: F10.1
GND: C19.2 C20.2 C21.2 C22.2 C23.2 C24.2 C25.2 C26.2 C27.2 C28.2 J10.1 J10.3 J10.9 J10.15 J10.21 J10.27 J10.33 J10.39 J10.45 J10.51 J10.57 J10.71 J10.73 J10.75 J10.76(MNT_1) J10.77(MNT_2) MP1.1 Q9.4(GND) R42.2 R46.1 R49.1 R51.1 Y1.2(GND)
M2_3V3: C19.1 C20.1 C21.1 C22.1 C23.1 C24.1 C25.1 C26.1 C27.1 D9.2(A) D9.3(A) J10.2 J10.4 J10.12 J10.14 J10.16 J10.18 J10.70 J10.72 J10.74 Q9.1(OUT) Q9.2(OUT) R40.1 R41.1 R48.1
ACT_LED: J10.10 R44.2
nPCIE_CLKREQ: J10.52 R37.1
nPCIE_RST: J10.50 R36.1 R41.2
nPCIE_WAKE: J10.54 R38.1
PCIE_CLK_N: J10.53 ; port PCIE_CLK_N
PCIE_CLK_P: J10.55 ; port PCIE_CLK_P
PCIE_nCLKREQ: R37.2 ; port nPCIE_CLKREQ
PCIE_nRST: R36.2 ; port nPCIE_RST
PCIE_nWAKE: R38.2 ; port nPCIE_WAKE
PCIE_PWR_EN: R45.2 ; port PCIE_PWR_EN
PCIE_RX0_N: J10.43 ; port PCIE_RX0_N
PCIE_RX0_P: J10.41 ; port PCIE_RX0_P
PCIE_TX0_N: J10.49 ; port PCIE_TX0_N
PCIE_TX0_P: J10.47 ; port PCIE_TX0_P
SMB_CLK: J10.40 TP1.1(TP)
SMB_DATA: J10.42 TP2.1(TP)
SMB_nALERT: J10.44 R40.2 TP3.1(TP)
SUSCLK_32: R39.1 R49.2 Y1.3(Output)
NetC28_1: C28.1 R48.2 R50.1 Y1.4(Vdd)
NetD9_1: D9.1(K) R42.1
NetD9_4: D9.4(K) R44.1
NetF10_2: F10.2 Q9.5(IN) Q9.6(IN) R43.2
NetJ10_68: J10.68 R39.2
NetQ9_3: Q9.3(EN) R43.1 R45.1 R46.2
NetR50_2: R50.2 R51.2 Y1.1(Tri-state)

Not connected (* = marked no-connect by the designer): J10 5* 6* 7* 8* 11* 13* 17* 19* 20* 22* 23* 24* 25* 26* 28* 29* 30* 31* 32* 34* 35* 36* 37* 38* 46* 48* 56* 58* 67* 69*

### Layout directives
differential pair; differential pair class 85DIFF: PCIE_CLK_N, PCIE_CLK_P, PCIE_RX0_N, PCIE_RX0_P, PCIE_TX0_N, PCIE_TX0_P
net class PWR: M2_3V3, NetF10_2

### Notes on the sheet
- M.2 KEY-M SLOT
- ROUTING GUIDELINES
  https://www.ti.com/lit/an/slaae45/slaae45.pdf
  Inter-pair skew up to 1m :)
  Intra-pair skew .15mm :(
- Copied from CM5IO schematics
- PULLUPS?
- (near TP2) Idk if these will be useful but expose them
- NO COULPING CAPS?
- (near R41) NOSTUFF - XAVIER
- POWER
- STAT LED
- (near D9) FOR STATUS LED (0-3V3)
- (near R42) NOSTUFF
- MECH
- 3X 10uF
- 6X 0.1uF
- SUSCLK PROVIDER
- Place one 10uF and two 0.1uF per 'bank' of supply pins
- #1 - not needed, #2 implement with simple crystal but test powering crystal off of 3v3
- (near Y1) TIE HI
- (near R51) NOSTUFF
- (near R49) NOSTUFF
- (near R49) Included for crystal cap if not using oscillator
- UNLABELLED RESISTORS ARE 0402 JUMPERS
- SCHEMATICS CHECKED - SEPT 25 2025
  - SUSCLK OK
  - M.2 PINOUT OK
  - LOAD SW OK
  - STANDOFF HEIGHT MATCHES CONN HEIGHT

### Library data of the parts
C19-C28 = CMP-001-00058-1: LARGE PADS, 0402 CAP, CHANGE COMMENT TO MATCH REAL P/N; Capacitor Type: Ceramic; Min Operating Temperature: -55°C; Mounting Technology: Surface Mount; Pins: 2; Case/Package: 0402; RoHS Compliant: Yes; Max Operating Temperature: 85°C
D9 = CMP-004-00040-2: Led, Red/Grn, 180Mcd/230Mcd, 624Nm/525Nm Rohs Compliant: Yes; Source: rgled.SchLib; Component Type: Standard; Pins: 4; Design Item ID: CMP-004-00034-2
F10 = CMP-16042-000006-1: FUSE BOARD MNT 5A 63VAC/VDC 1206; RoHS Compliant: Yes
J10 = CMP-03365-000001-1: CONN EDGE DUAL FMALE 67POS 0.020; Manufacturer: TE; Number Of Contacts: 67; Current Rating: 0.5A; Pitch: 0.5mm; Conn Gender: Female; Is Female: yes; Voltage Rating: 50V; Conn Orientation: Right Angle; Automotive: No; Temperature Range High: +80°C; Package: 1-2199230-6; Category: Conn; Temperature: -40°C to +80°C; Number Of Rows: 2; ComponentLink2URL: http://www.te.com/commerce/DocumentDelivery/DDEController?Action=showdoc&DocId=Specification+Or+Standard%7F114-115006%7FB%7Fpdf%7FEnglish%7FENG_SS_114-115006_B_114-115006_REV_B.pdf%7F1-2199230-6; Manufacturer Part Number: 1-2199230-6; Height: 4.2mm; RoHS: TRUE; Footprint Url: http://www.te.com/commerce/DocumentDelivery/DDEController?Action=showdoc&DocId=Customer+Drawing%7F2199230%7FB2%7Fpdf%7FEnglish%7FENG_CD_2199230_B2.pdf%7F1-2199230-6; Digikey Description: CONN EDGE DUAL FMALE 67POS 0.020; Device Class L2: Card Edge Connectors; Contact Material: Gold,Tin; Device Class L1: Connectors; Device Class L3: unset; ComponentLink2Description: Datasheet; Temperature Range Low: -40°C; Octopart: https://octopart.com/1-2199230-6-te+connectivity-34969376; Lead Free: Yes
MP1 = CMP-03913-59774857-1: 9774025243R Spacer Material: Steel, Tin-Plated Mounting: SMT Series: WA-SMST Thread D: M2; Outside Diameter: 4.3434mm; Threaded/Unthreaded: Threaded; Plating: Tin; REACH SVHC: Unknown; NexarPartId: 59774857; RoHS: Compliant; Material: Steel; Packaging: Tape and Reel; Max Operating Temperature: 150°C; Min Operating Temperature: -55°C; Length: 2.5mm; Height: 2.5mm
Q9 = CMP-019-00054-1: Power Switch ICs – Power Distribution; VISHAY; SIP32510DT-T1-GE3; 1; 1; 5.5 V; SOT-23-6; Max Supply Voltage: 5.5V; Max Power Dissipation: 833mW; Min Supply Voltage: 1.2V; Case/Package: SOT-23-6; Mounting Technology: Surface Mount; Max Operating Temperature: 85°C; Min Operating Temperature: -40°C
R36-R38 R48-R51 = CMP-009-00118-2: READ THE NAME; Pins: 2; Component Type: Standard; Design Item ID: CMP-009-00206-2; Source: 0402jump.SchLib
R39-R46 = CMP-009-00002-14: Resistor
  R39: Value: 330
  R40 R41 R46: Value: 100k
  R42 R44 R45: Value: 1k
  R43: Value: DNP
TP1-TP3 = CMP-00025-2: Test Point .6mm
Y1 = CMP-27762-001115-1: XTAL OSC XO 32.7680KHZ CMOS SMD; Load Capacitance: 15pF; Max Supply Current: 3.5mA; Min Supply Voltage: 2.97V; Operating Supply Voltage: 3.3V; Frequency Stability: 25ppm; Lead Free: Lead Free; Case/Package: CSMD; Number of Pins: 4; Max Operating Temperature: 85°C; Packaging: Tape and Reel; Width: 0.079inch; Min Operating Temperature: -40°C; Radiation Hardening: No; Length: 2.5mm; Depth: 2mm; Termination: SMD/SMT; Height: 0.037inch; Series: ASDK; Frequency: 32.768kHz; Mount: Surface Mount

## Sheet MCP2515_PINOUT.SchDoc
size A; SheetNumber: 6; SheetTotal: 17
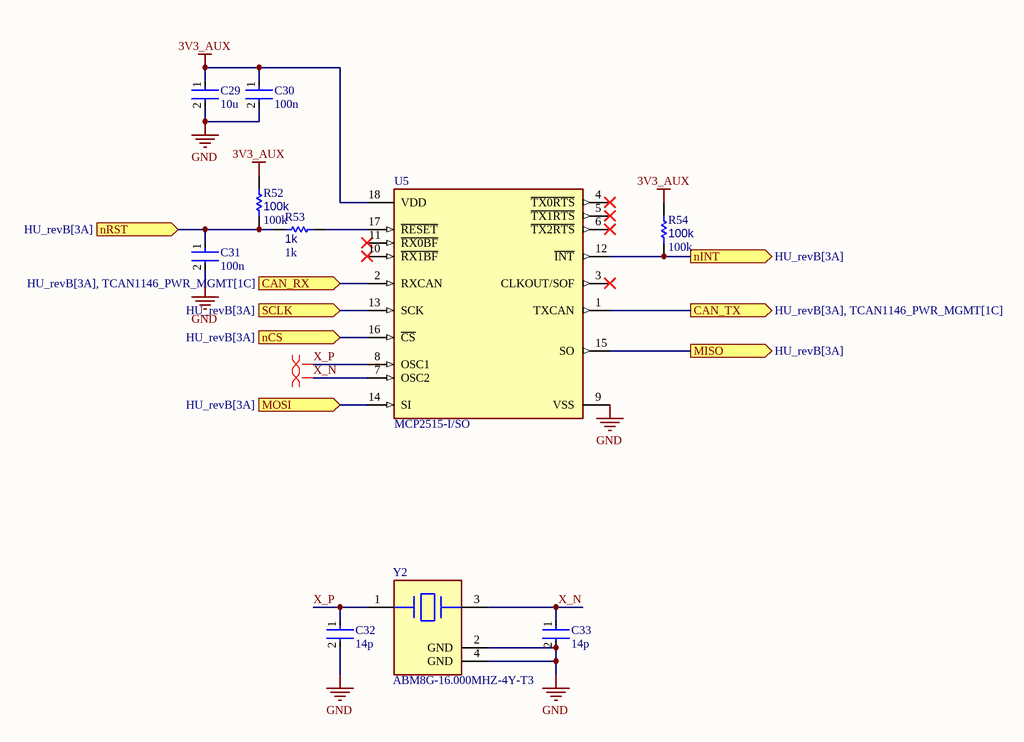
[diagram p13: MCP2515_PINOUT.SchDoc]

### Parts
(Parts that share a designator on the sheet are numbered #1, #2 ... from top to bottom, then left to right.)
C29  10u  [FP-0402-L_1_0_0_05-W_0_5-IPC_A]
C30  100n  [FP-0402-L_1_0_0_05-W_0_5-IPC_A]
C31#1  100n  [FP-0402-L_1_0_0_05-W_0_5-IPC_A]
C32  14p  [FP-0402-L_1_0_0_05-W_0_5-IPC_A]
C33  14p  [FP-0402-L_1_0_0_05-W_0_5-IPC_A]
R52  100k  [R0603B]
R53#1  1k  [R0603B]
R54  100k  [R0603B]
U5  MCP2515-I/SO  [FP-C04-051-MFG]
Y2  ABM8G-16.000MHZ-4Y-T3  [FP-ABM8G-MFG]

### Ports
CAN_RX (in, see HU_revB[3A], TCAN1146_PWR_MGMT[1C]), CAN_TX (out, see HU_revB[3A], TCAN1146_PWR_MGMT[1C]), MISO (out, see HU_revB[3A]), MOSI (in, see HU_revB[3A]), nCS (in, see HU_revB[3A]), nINT (out, see HU_revB[3A]), nRST (in, see HU_revB[3A]), SCLK (in, see HU_revB[3A])

### Nets
3V3_AUX: C29.1 C30.1 R52.1 R54.1 U5.18(VDD)
GND: C29.2 C30.2 C31#1.2 C32.2 C33.2 U5.9(VSS) Y2.2(GND) Y2.4(GND)
SPI0_MISO: U5.15(SO) ; port MISO
SPI0_MOSI: U5.14(SI) ; port MOSI
SPI0_nCS0: U5.16(~{CS}) ; port nCS
SPI0_SCLK: U5.13(SCK) ; port SCLK
X_N: C33.1 U5.7(OSC2) Y2.3
X_P: C32.1 U5.8(OSC1) Y2.1
NetC31#1_1: C31#1.1 R52.2 R53#1.2 ; port nRST
NetR53#1_1: R53#1.1 U5.17(~{RESET})
NetR54_2: R54.2 U5.12(~{INT}) ; port nINT
NetU2_1: U5.1(TXCAN) ; port CAN_TX
NetU2_4: U5.2(RXCAN) ; port CAN_RX

Not connected (* = marked no-connect by the designer): U5 3(CLKOUT/SOF)* 4(~{TX0RTS})* 5(~{TX1RTS})* 6(~{TX2RTS})* 10(~{RX1BF})* 11(~{RX0BF})*

### Layout directives
differential pair: X_N, X_P

### Library data of the parts
C29 C30 C31#1 C32 C33 = CMP-001-00058-1: as C19-C28 on sheet NVME; Min Operating Temperature: -55°C; Mounting Technology: Surface Mount; Pins: 2; Case/Package: 0402; RoHS Compliant: Yes; Max Operating Temperature: 85°C
R52 R53#1 R54 = CMP-009-00002-14: Resistor
  R52 R54: Value: 100k
  R53#1: Value: 1k
U5 = CMP-0186-00133-3: IC CAN CONTROLLER W/SPI 18SOIC; Manufacturer: Microchip; Min Supply Voltage: 2.7V; Max Supply Voltage: 5.5V; Standoff Height: 0.1mm; Nominal Supply Current: 10mA; Interface: SPI,CAN; Lead Free: Yes; Digikey Description: IC CAN CONTROLLER W/SPI 18SOIC; Category: IC; RoHS: TRUE; Manufacturer Part Number: MCP2515-I/SO; ComponentLink2URL: http://ww1.microchip.com/downloads/en/DeviceDoc/MCP2515-Stand-Alone-CAN-Controller-with-SPI-20001801J.pdf; Mouser Description: CAN Interface IC W/ SPI Interface; Device Class L2: Interface ICs; Package: C04-051; Automotive: No; Function: Controller; Octopart: https://octopart.com/mcp2515-i%2Fso-microchip-430187; Temperature: -40°C to +85°C; Ipc Land Pattern Name: SOIC127P1030X265-18; Ambient Temperature Range Low: -65°C; Height: 2.65mm; Device Class L1: Integrated Circuits (ICs); Ambient Temperature Range High: +125°C; Footprint Url: http://ww1.microchip.com/downloads/en/DeviceDoc/18L_SOIC_Wide_7.50_SO_C04-0051D.pdf; Temperature Range Low: -40°C; Device Class L3: Controllers; Temperature Range High: +85°C; ComponentLink2Description: Datasheet
Y2 = CMP-27762-015134-1: Crystal 16MHz ±30ppm (Tol) ±30ppm (Stability) 10pF FUND 80Ω 4-Pin SMD T/R; Series Resistance: 80R; Mount: Surface Mount; Width: 0.098inch; Load Capacitance: 10pF; Length: 3.2mm; Series: ABM8G; Max Operating Temperature: 60°C; Depth: 2.5mm; Frequency: 16MHz; Frequency Tolerance: 30ppm; Height: 0.039inch; ESR (Equivalent Series Resistance): 80R; Case/Package: SMD/SMT; Lead Free: Lead Free; Frequency Stability: 30ppm; Packaging: Tape and Reel; Number of Pins: 4; REACH SVHC: No SVHC; Min Operating Temperature: -10°C

## Sheet SD.SchDoc
size A4; SheetNumber: 8; SheetTotal: 17
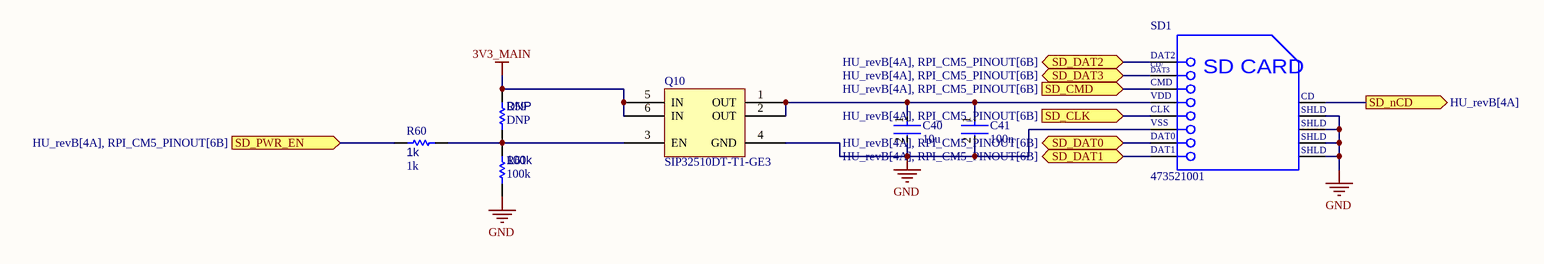
[diagram p14: SD.SchDoc]

### Parts
C40  10u  [FP-0402-L_1_0_0_05-W_0_5-IPC_A]
C41  100n  [FP-0402-L_1_0_0_05-W_0_5-IPC_A]
Q10  SIP32510DT-T1-GE3  [SOT95P284X110-6N]
R59  DNP  [R0603B]
R60  1k  [R0603B]
R61  100k  [R0603B]
SD1  473521001  [MOLX-473521001_V]

### Ports
SD_CLK (in, see HU_revB[4A], RPI_CM5_PINOUT[6B]), SD_CMD (in, see HU_revB[4A], RPI_CM5_PINOUT[6B]), SD_DAT0 (bidir, see HU_revB[4A], RPI_CM5_PINOUT[6B]), SD_DAT1 (bidir, see HU_revB[4A], RPI_CM5_PINOUT[6B]), SD_DAT2 (bidir, see HU_revB[4A], RPI_CM5_PINOUT[6B]), SD_DAT3 (bidir, see HU_revB[4A], RPI_CM5_PINOUT[6B]), SD_nCD (out, see HU_revB[4A]), SD_PWR_EN (in, see HU_revB[4A], RPI_CM5_PINOUT[6B])

### Nets
3V3_MAIN: Q10.5(IN) Q10.6(IN) R59.2
GND: C40.2 C41.2 Q10.4(GND) R61.1 SD1.6(VSS) SD1.10(SHLD) SD1.11(SHLD) SD1.12(SHLD) SD1.13(SHLD)
SD_CLK: SD1.5(CLK) ; port SD_CLK
SD_CMD: SD1.3(CMD) ; port SD_CMD
SD_DAT0: SD1.7(DAT0) ; port SD_DAT0
SD_DAT1: SD1.8(DAT1) ; port SD_DAT1
SD_DAT2: SD1.1(DAT2) ; port SD_DAT2
SD_DAT3: SD1.2(CD/DAT3) ; port SD_DAT3
SD_PWR_EN: R60.2 ; port SD_PWR_EN
NetC40_1: C40.1 C41.1 Q10.1(OUT) Q10.2(OUT) SD1.4(VDD)
NetQ10_3: Q10.3(EN) R59.1 R60.1 R61.2
NetSD1_9: SD1.9(CD) ; port SD_nCD

### Notes on the sheet
- (in symbol CMP-2000-05848-1) CD/; DAT3; SD CARD

### Library data of the parts
C40 C41 = CMP-001-00058-1: as C19-C28 on sheet NVME; Min Operating Temperature: -55°C; Mounting Technology: Surface Mount; Pins: 2; Case/Package: 0402; RoHS Compliant: Yes; Max Operating Temperature: 85°C
Q10 = CMP-019-00054-1: as Q9 on sheet NVME; Case/Package: SOT-23-6; Mounting Technology: Surface Mount; Max Operating Temperature: 85°C; Min Operating Temperature: -40°C
R59-R61 = CMP-009-00002-14: Resistor
  R59: Value: DNP
  R60: Value: 1k
  R61: Value: 100k
SD1 = CMP-2000-05848-1: MicroSD(TM), Pitch 1.1 mm, 8 Position, Height 1.88 mm, -20 to 85 degC, RoHS, Tape and Reel; Manufacturer: Molex; Datasheet Version: Rev. G, 01/2012; Datasheet URL: http://www.molex.com/pdm_docs/sd/473521001_sd.pdf; Package Reference: 473521001; Manufacturer URL: http://www.molex.com/; Mounting Technology: SurfaceMount; Package Description: MicroSD(TM), Pitch 1.1 mm, 8 Position, Height 1.88 mm

## Sheet HDMI.SchDoc
size A4; SheetNumber: 10; SheetTotal: 17
Used 2 times, as channels DISP_0, DISP_1. Parts and nets are listed once, with the designators drawn on the sheet.
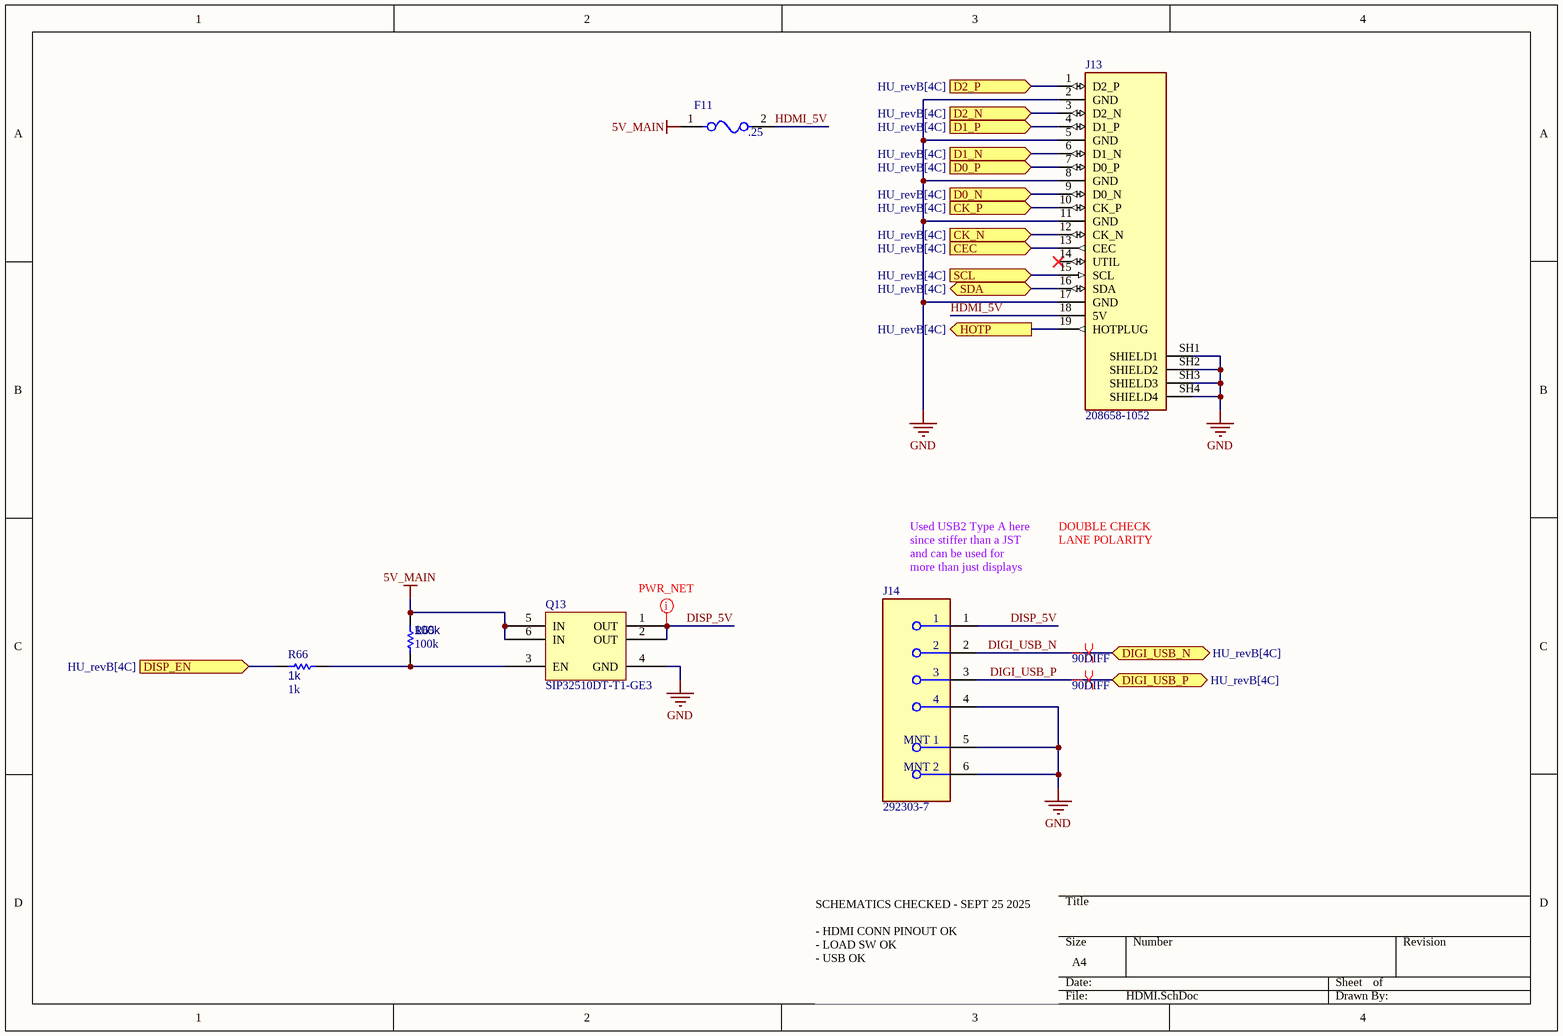
[diagram p15: HDMI.SchDoc]

### Parts
F11  .25  [FP-0685T-MFG]
J13  208658-1052  [208658-1052-Footprint-1]
J14  292303-7  [FP-292303-7-MFG]
Q13  SIP32510DT-T1-GE3  [SOT95P284X110-6N]
R65  100k  [R0603B]
R66  1k  [R0603B]

### Ports
CEC (in, see HU_revB[4C]), CK_N (in, see HU_revB[4C]), CK_P (in, see HU_revB[4C]), D0_N (in, see HU_revB[4C]), D0_P (in, see HU_revB[4C]), D1_N (in, see HU_revB[4C]), D1_P (in, see HU_revB[4C]), D2_N (in, see HU_revB[4C]), D2_P (in, see HU_revB[4C]), DIGI_USB_N (bidir, see HU_revB[4C]), DIGI_USB_P (bidir, see HU_revB[4C]), DISP_EN (in, see HU_revB[4C]), HOTP (out, see HU_revB[4C]), SCL (in, see HU_revB[4C]), SDA (bidir, see HU_revB[4C])

### Nets
5V_MAIN: F11.1 Q13.5(IN) Q13.6(IN) R65.2
GND: J13.2(GND) J13.5(GND) J13.8(GND) J13.11(GND) J13.17(GND) J13.SH1(SHIELD1) J13.SH2(SHIELD2) J13.SH3(SHIELD3) J13.SH4(SHIELD4) J14.4 J14.5(MNT_1) J14.6(MNT_2) Q13.4(GND)
CEC: J13.13(CEC) ; port CEC
CK_N: J13.12(CK_N) ; port CK_N
CK_P: J13.10(CK_P) ; port CK_P
D0_N: J13.9(D0_N) ; port D0_N
D0_P: J13.7(D0_P) ; port D0_P
D1_N: J13.6(D1_N) ; port D1_N
D1_P: J13.4(D1_P) ; port D1_P
D2_N: J13.3(D2_N) ; port D2_N
D2_P: J13.1(D2_P) ; port D2_P
DIGI_USB_N: J14.2 ; port DIGI_USB_N
DIGI_USB_P: J14.3 ; port DIGI_USB_P
DISP_5V: J14.1 Q13.1(OUT) Q13.2(OUT)
DISP_EN: R66.2 ; port DISP_EN
HDMI_5V: F11.2 J13.18(5V)
HOTP: J13.19(HOTPLUG) ; port HOTP
SCL: J13.15(SCL) ; port SCL
SDA: J13.16(SDA) ; port SDA
NetQ13_3: Q13.3(EN) R65.1 R66.1

Not connected (* = marked no-connect by the designer): J13 14(UTIL)*

### Channels
DISP_0: designators end in _DISP_0; ports CEC=HDMI0_CEC CK_N=HDMI0_CK_N CK_P=HDMI0_CK_P D0_N=HDMI0_D0_N D0_P=HDMI0_D0_P D1_N=HDMI0_D1_N D1_P=HDMI0_D1_P D2_N=HDMI0_D2_N D2_P=HDMI0_D2_P DIGI_USB_N=DIGI_USB_N DIGI_USB_P=DIGI_USB_P DISP_EN=NetR66_DISP_0_2 HOTP=HDMI0_HOTP SCL=HDMI0_SCL SDA=HDMI0_SDA
DISP_1: designators end in _DISP_1; ports CEC=HDMI1_CEC CK_N=HDMI1_CK_N CK_P=HDMI1_CK_P D0_N=HDMI1_D0_N D0_P=HDMI1_D0_P D1_N=HDMI1_D1_N D1_P=HDMI1_D1_P D2_N=HDMI1_D2_N D2_P=HDMI1_D2_P DIGI_USB_N=DIGI_USB_N DIGI_USB_P=DIGI_USB_P DISP_EN=NetR66_DISP_1_2 HOTP=HDMI1_HOTP SCL=HDMI1_SCL SDA=HDMI1_SDA

### Layout directives
differential pair; differential pair class 90DIFF: DIGI_USB_N, DIGI_USB_P
net class PWR: DISP_5V_DISP_0

### Notes on the sheet
- Used USB2 Type A here since stiffer than a JST and can be used for more than just displays
- DOUBLE CHECK LANE POLARITY
- SCHEMATICS CHECKED - SEPT 25 2025
  - HDMI CONN PINOUT OK
  - LOAD SW OK
  - USB OK

### Library data of the parts
F11 = CMP-16042-000006-1: FUSE BOARD MNT 5A 63VAC/VDC 1206; RoHS Compliant: Yes
J13 = CMP-002-00089-3: HDMI CONNECTOR, RCPT, 19POS, SMT; Available until stocks are exhausted Alternative available; Gender: Female; Min Operating Temperature: -20°C; Max Operating Temperature: 85°C; Pins: 19
J14 = CMP-03360-000008-1: CONN RCPT USB2.0 TYPEA 4P SMD RA; Manufacturer: TE Connectivity; Is Female: yes; Current Rating: 1A; Number Of Contacts: 4; Voltage Rating: 30V; Conn Orientation: Right Angle; Shielding: true; Digikey Description: CONN RCPT USB2.0 TYPEA 4P SMD RA; Manufacturer Part Number: 292303-7; Automotive: No; Category: Conn; Temperature: -55°C to +85°C; ComponentLink2Description: Datasheet; Mouser Description: USB Connectors USB A R/A Recpt Assy SMT; Contact Material: Gold,Nickel; Package: 292303-7; Device Class L3: unset; Octopart: https://octopart.com/292303-7-te+connectivity-42840369; RoHS: TRUE; Device Class L2: USB Connectors; ComponentLink2URL: https://www.te.com/usa-en/product-292303-7.html?te_bu=Cor&te_type=other&te_campaign=oct_glo_cor-oct-global-oth-prtnr-fy19-oct-octo-buy-bom_sma-298_2&elqCampaignId=35216; Temperature Range Low: -55°C; Usb Standard: USB 2.0; Temperature Range High: +85°C; Lead Free: Yes; Device Class L1: Connectors
Q13 = CMP-019-00054-1: as Q9 on sheet NVME; Case/Package: SOT-23-6; Mounting Technology: Surface Mount; Max Operating Temperature: 85°C; Min Operating Temperature: -40°C
R65 R66 = CMP-009-00002-14: Resistor
  R65: Value: 100k
  R66: Value: 1k

## Sheet TUSB2036_PINOUT.SchDoc
size B; SheetNumber: 11; SheetTotal: 17
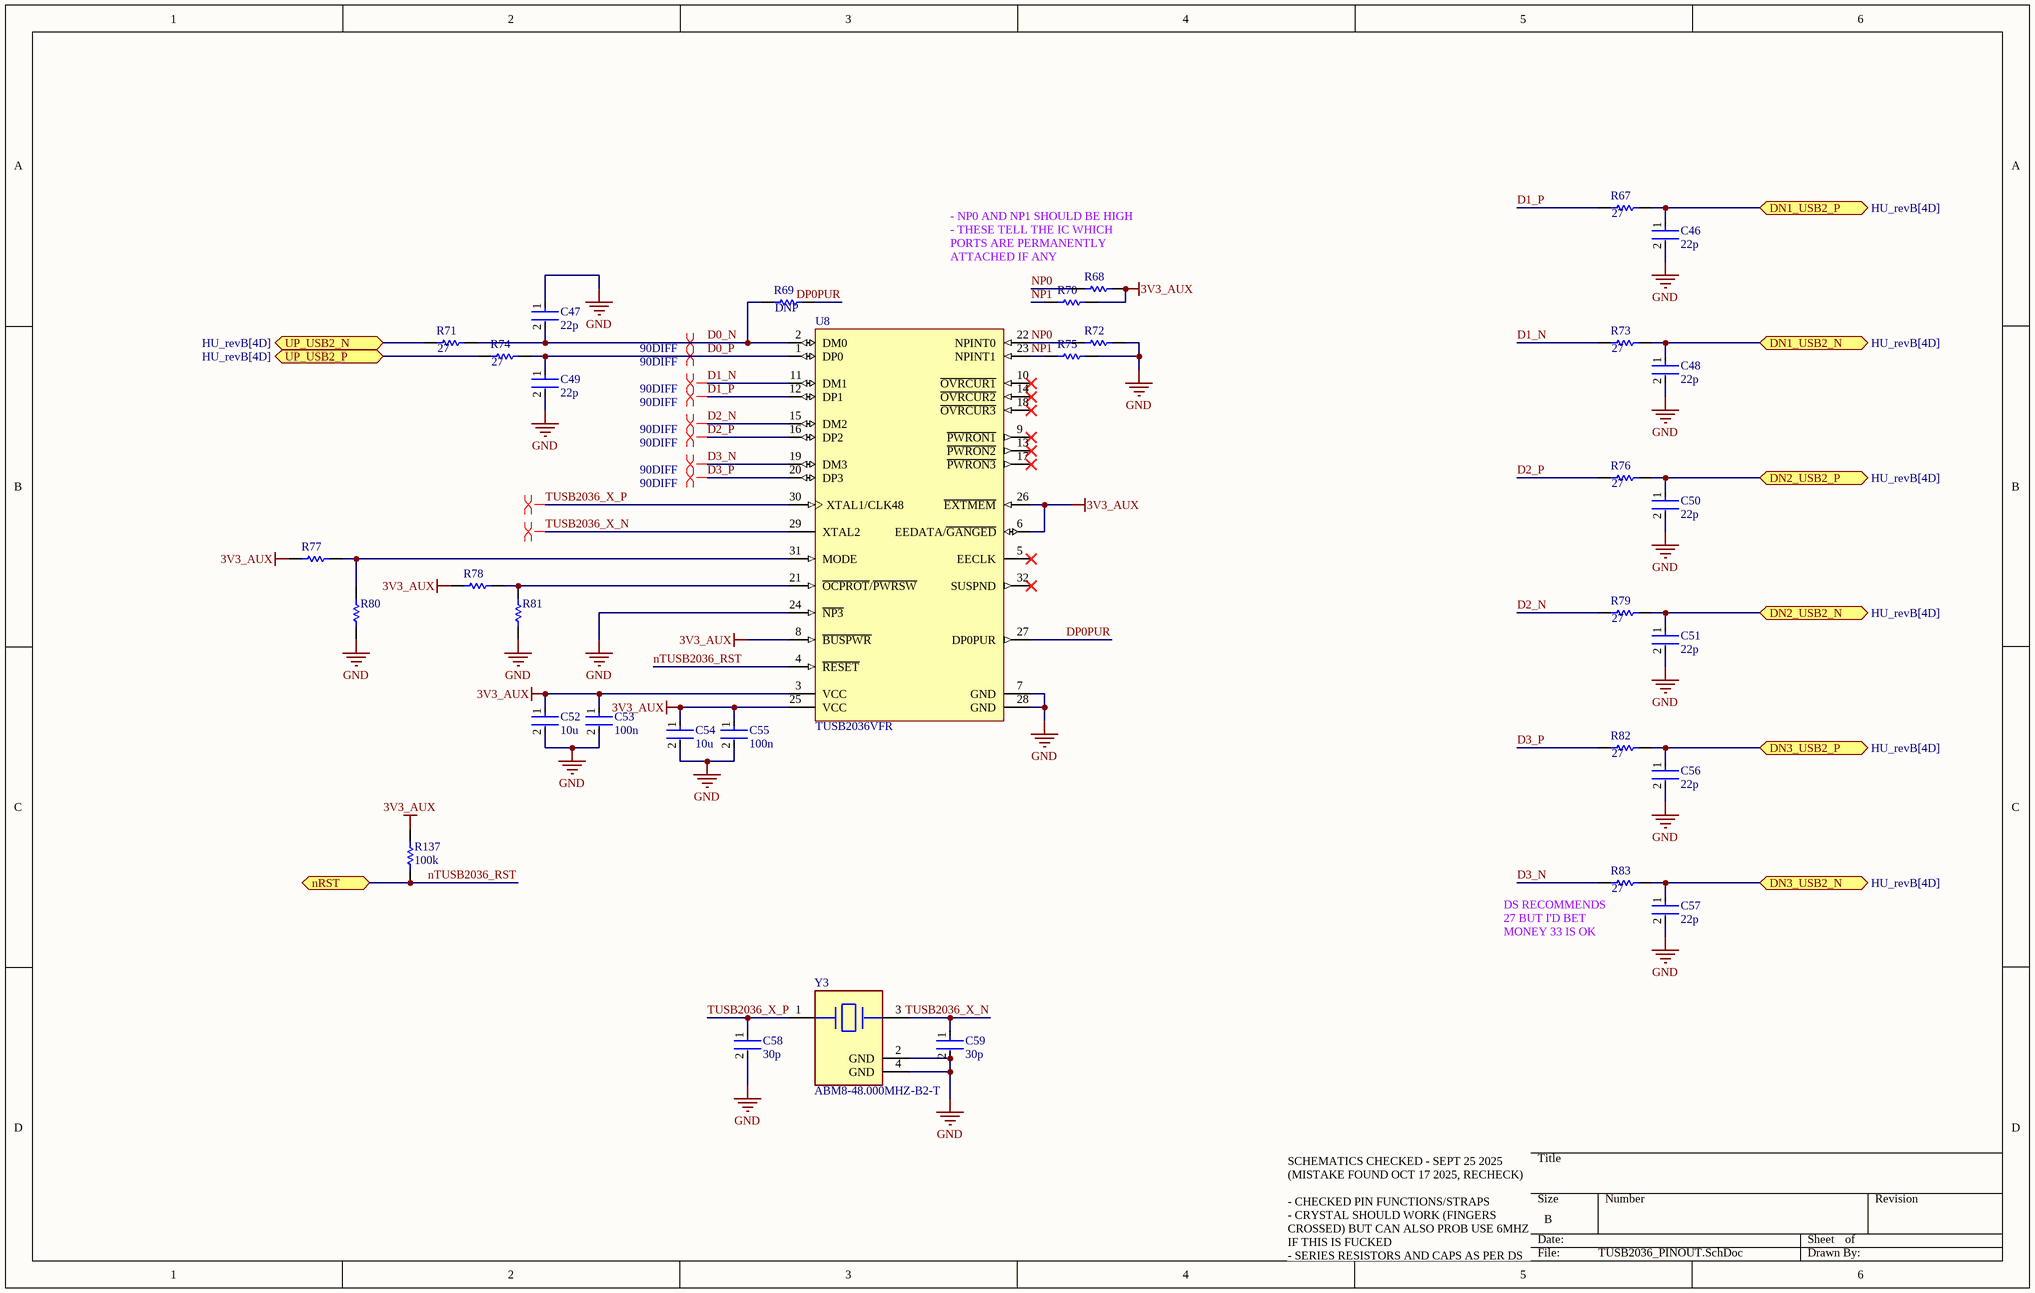
[diagram p16: TUSB2036_PINOUT.SchDoc]

### Parts
C46  22p  [FP-0402-L_1_0_0_05-W_0_5-IPC_A]
C47  22p  [FP-0402-L_1_0_0_05-W_0_5-IPC_A]
C48  22p  [FP-0402-L_1_0_0_05-W_0_5-IPC_A]
C49  22p  [FP-0402-L_1_0_0_05-W_0_5-IPC_A]
C50  22p  [FP-0402-L_1_0_0_05-W_0_5-IPC_A]
C51  22p  [FP-0402-L_1_0_0_05-W_0_5-IPC_A]
C52  10u  [FP-0402-L_1_0_0_05-W_0_5-IPC_A]
C53  100n  [FP-0402-L_1_0_0_05-W_0_5-IPC_A]
C54  10u  [FP-0402-L_1_0_0_05-W_0_5-IPC_A]
C55  100n  [FP-0402-L_1_0_0_05-W_0_5-IPC_A]
C56  22p  [FP-0402-L_1_0_0_05-W_0_5-IPC_A]
C57  22p  [FP-0402-L_1_0_0_05-W_0_5-IPC_A]
C58  30p  [FP-0402-L_1_0_0_05-W_0_5-IPC_A]
C59  30p  [FP-0402-L_1_0_0_05-W_0_5-IPC_A]
R67  27  [R0603B]
R68  0402 JUMPER  [RESC1005X40X25ML05T05]  (value not drawn)
R69  DNP  [R0603B]
R70  0402 JUMPER  [RESC1005X40X25ML05T05]  (value not drawn)
R71  27  [R0603B]
R72  0402 JUMPER  [RESC1005X40X25ML05T05]  (value not drawn)
R73  27  [R0603B]
R74  27  [R0603B]
R75  0402 JUMPER  [RESC1005X40X25ML05T05]  (value not drawn)
R76  27  [R0603B]
R77  0402 JUMPER  [RESC1005X40X25ML05T05]  (value not drawn)
R78  0402 JUMPER  [RESC1005X40X25ML05T05]  (value not drawn)
R79  27  [R0603B]
R80  DNP  [RESC1005X40X25ML05T05]  (value not drawn)
R81  DNP  [RESC1005X40X25ML05T05]  (value not drawn)
R82  27  [R0603B]
R83  27  [R0603B]
R137  100k  [R0603B]
U8  TUSB2036VFR  [VF0032A_M]
Y3  ABM8-48.000MHZ-B2-T  [FP-ABM8-MFG]

### Ports
DN1_USB2_N (bidir, see HU_revB[4D]), DN1_USB2_P (bidir, see HU_revB[4D]), DN2_USB2_N (bidir, see HU_revB[4D]), DN2_USB2_P (bidir, see HU_revB[4D]), DN3_USB2_N (bidir, see HU_revB[4D]), DN3_USB2_P (bidir, see HU_revB[4D]), nRST (bidir), UP_USB2_N (bidir, see HU_revB[4D]), UP_USB2_P (bidir, see HU_revB[4D])

### Nets
3V3_AUX: C52.1 C53.1 C54.1 C55.1 R68.2 R70.2 R77.2 R78.2 R137.2 U8.3(VCC) U8.6(EEDATA/~{GANGED}) U8.8(~{BUSPWR}) U8.25(VCC) U8.26(~{EXTMEM})
GND: C46.2 C47.1 C48.2 C49.2 C50.2 C51.2 C52.2 C53.2 C54.2 C55.2 C56.2 C57.2 C58.2 C59.2 R72.2 R75.2 R80.1 R81.1 U8.7(GND) U8.24(~{NP3}) U8.28(GND) Y3.2(GND) Y3.4(GND)
D0_N: C47.2 R69.2 R71.1 U8.2(DM0)
D0_P: C49.1 R74.1 U8.1(DP0)
D1_N: R73.2 U8.11(DM1)
D1_P: R67.2 U8.12(DP1)
D2_N: R79.2 U8.15(DM2)
D2_P: R76.2 U8.16(DP2)
D3_N: R83.2 U8.19(DM3)
D3_P: R82.2 U8.20(DP3)
DIGI_USB_N: C57.1 R83.1 ; port DN3_USB2_N
DIGI_USB_N: C51.1 R79.1 ; port DN2_USB2_N  [a separate net that carries the same name]
DIGI_USB_P: C56.1 R82.1 ; port DN3_USB2_P
DIGI_USB_P: C50.1 R76.1 ; port DN2_USB2_P  [a separate net that carries the same name]
DP0PUR: R69.1 U8.27(DP0PUR)
NP0: R68.1 R72.1 U8.22(NPINT0)
NP1: R70.1 R75.1 U8.23(NPINT1)
nTUSB2036_RST: R137.1 U8.4(~{RESET}) ; port nRST
TUSB2036_X_N: C59.1 U8.29(XTAL2) Y3.3
TUSB2036_X_P: C58.1 U8.30(XTAL1/CLK48) Y3.1
USB3_0_D_N: R71.2 ; port UP_USB2_N
USB3_0_D_P: R74.2 ; port UP_USB2_P
NetC46_1: C46.1 R67.1 ; port DN1_USB2_P
NetC48_1: C48.1 R73.1 ; port DN1_USB2_N
NetR77_1: R77.1 R80.2 U8.31(MODE)
NetR78_1: R78.1 R81.2 U8.21(~{OCPROT}/~{PWRSW})

Not connected (* = marked no-connect by the designer): U8 5(EECLK)* 9(~{PWRON1})* 10(~{OVRCUR1})* 13(~{PWRON2})* 14(~{OVRCUR2})* 17(~{PWRON3})* 18(~{OVRCUR3})* 32(SUSPND)*

### Layout directives
differential pair: TUSB2036_X_N, TUSB2036_X_P
differential pair; differential pair class 90DIFF: D0_N, D0_P, D1_N, D1_P, D2_N, D2_P, D3_N, D3_P

### Notes on the sheet
- - NP0 AND NP1 SHOULD BE HIGH
  - THESE TELL THE IC WHICH PORTS ARE PERMANENTLY ATTACHED IF ANY
- (near R83) DS RECOMMENDS 27 BUT I'D BET MONEY 33 IS OK
- SCHEMATICS CHECKED - SEPT 25 2025 (MISTAKE FOUND OCT 17 2025, RECHECK)
  - CHECKED PIN FUNCTIONS/STRAPS
  - CRYSTAL SHOULD WORK (FINGERS CROSSED) BUT CAN ALSO PROB USE 6MHZ IF THIS IS FUCKED
  - SERIES RESISTORS AND CAPS AS PER DS

### Library data of the parts
C46-C59 = CMP-001-00058-1: as C19-C28 on sheet NVME; Min Operating Temperature: -55°C; Mounting Technology: Surface Mount; Pins: 2; Case/Package: 0402; RoHS Compliant: Yes; Max Operating Temperature: 85°C
R67 R69 R71 R73 R74 R76 R79 R82 R83 R137 = CMP-009-00002-14: Resistor
  R67 R71 R73 R74 R76 R79 R82 R83: Value: 27
  R69: Value: DNP
R68 R70 R72 R75 R77 R78 R80 R81 = CMP-009-00118-2: READ THE NAME; Pins: 2; Component Type: Standard; Design Item ID: CMP-009-00206-2; Source: 0402jump.SchLib
U8 = CMP-0309-00082-2: 2 / 3-Port Hub for USB with Optional Serial EEPROM Interface, 3.3V, 0 to 70 degC, 32-Pin LQFP (VF), Green (RoHS & no Sb/Br); Manufacturer: Texas Instruments; Supply Voltage(s)(V): 3.3; SubFamily: USB Hub Controller; USB Speed: Full; USB Full Speed: True; PackageReference: VF0032A; ComponentLink2URL: http://www.ti.com/litv/pdf/mtqf002b; PackageDescription: 32-Pin Plastic Quad Flatpack, 7 x 7 mm Body, 0.8 mm Pitch; Integrated MCU Architecture: N/A; DatasheetVersion: SLLS372E; ComponentLink1URL: http://www.ti.com/general/docs/lit/getliterature.tsp?genericPartNumber=TUSB2036&fileType=pdf; Eco-Plan: Green (RoHS & no Sb/Br); PartNumber: TUSB2036VFR; Mounting Technology: Surface Mount; ComponentLink1Description: Datasheet; PackageVersion: revD, Apr-2000; ComponentLink2Description: Package Specification
Y3 = CMP-27762-011708-1: Crystal 48MHz ±20ppm 18pF SMD-4 3.2mm x 2.5mm; Series Resistance: 35R; Frequency Stability: 50ppm; Package Quantity: 1000; Packaging: Tape and Reel; Mount: Surface Mount; Length: 3.2mm; Load Capacitance: 18pF; Max Operating Temperature: 70°C; Operating Frequency: 48 MHz; RoHS Compliant: Yes; Series: ABM8; Frequency Tolerance: 20ppm; Lead Free: Lead Free; Min Operating Temperature: -20°C; Case/Package: CSMD; Number of Pins: 4; Height: 0.031inch; ESR (Equivalent Series Resistance): 35R; Frequency: 48MHz; Radiation Hardening: No; Width: 0.098inch; Tolerance: 20ppm; Termination: SMD/SMT; Depth: 2.5mm; Resistor Type: Ceramic; REACH SVHC: No SVHC